# Altium project motor_driver_unit_v0.PrjPcb
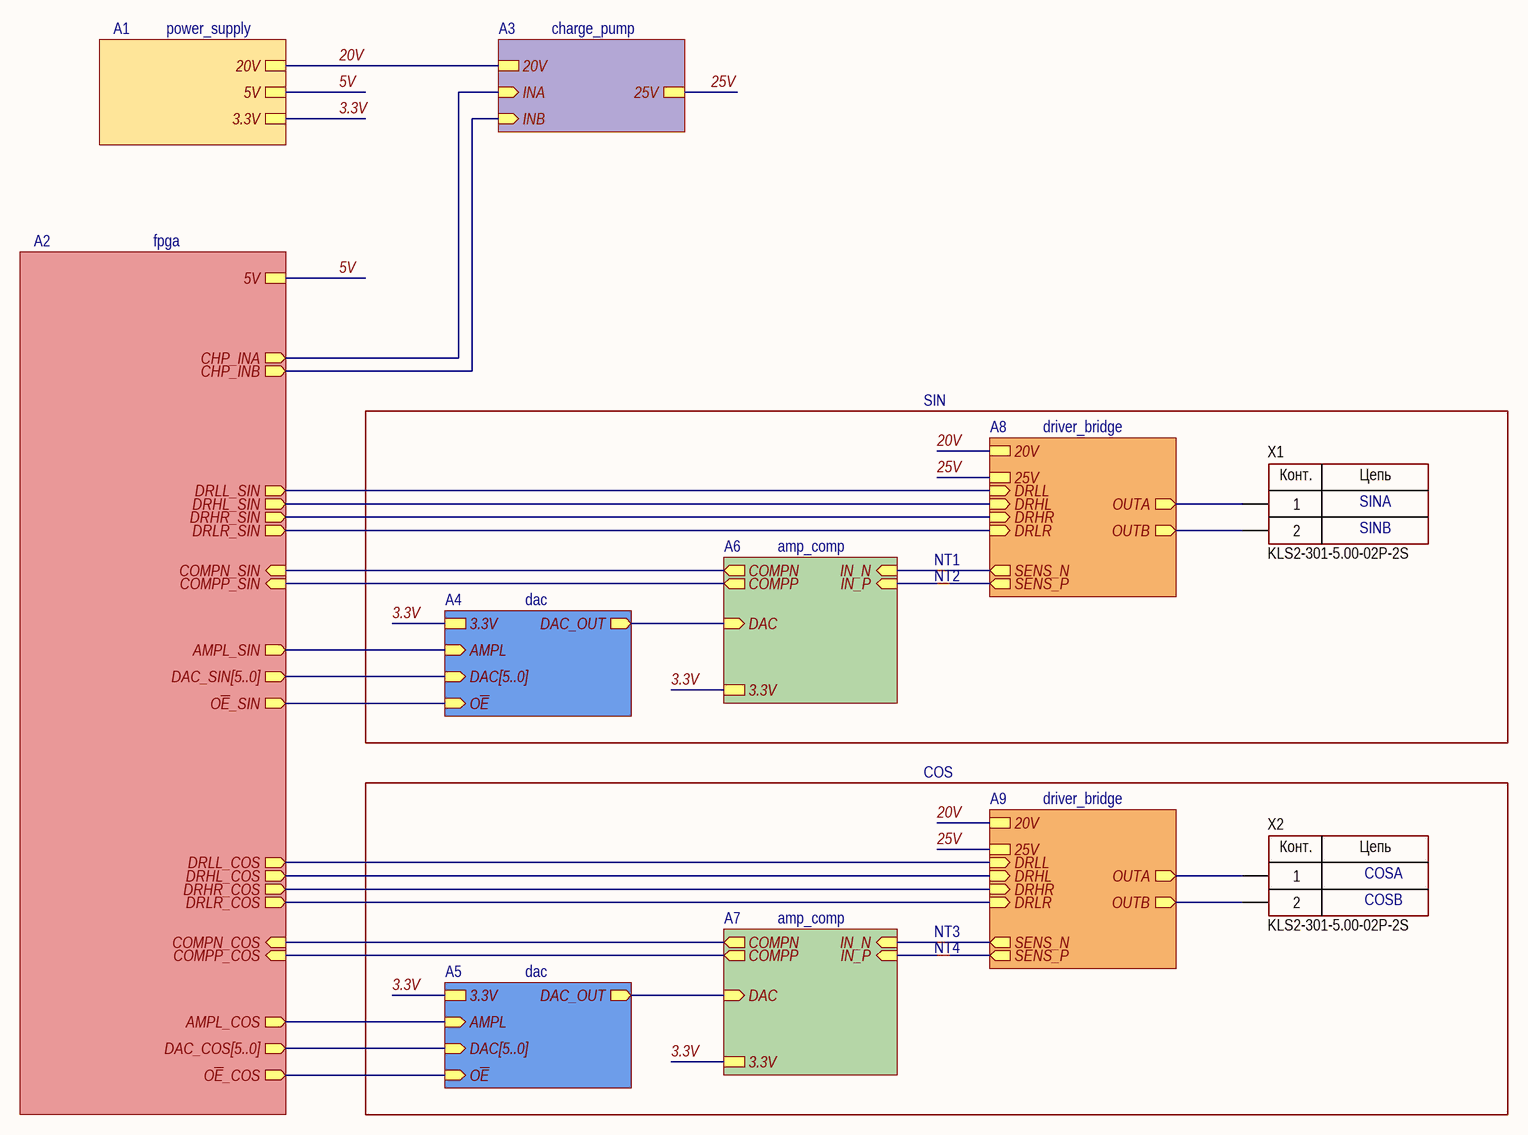
[diagram p0: main.SchDoc]
7 sheets, 191 parts. Net scope: hierarchical (ports join the sheet entries above them; power ports are global).
Board file: motor_driver_unit_pcb.PcbDoc
Sheets:
  main.SchDoc
    A3 = charge_pump.SchDoc
    A8 = driver_bridge.SchDoc
    A6 = amp_comp.SchDoc
    A4 = dac.SchDoc
    A1 = power_supply.SchDoc
    A2 = fpga.SchDoc
    A9 = driver_bridge.SchDoc
    A7 = amp_comp.SchDoc
    A5 = dac.SchDoc

## Sheet main.SchDoc
size 420 x 297 mm; Address1: Address1; Address2: Address2; Address3: Address3; Address4: Address4; DocumentNumber: АБВГ.123456.001 Э3; SheetNumber: 1; SheetTotal: 7; Scale: 1:1; DocumentType: Схема электрическая принципиальная; FirstReferrence: АБВГ.123456.001

### Parts
NT1  Net_Tie  [NET TIE 0.5_1.5]  (value not drawn)
NT2  Net_Tie  [NET TIE 0.5_1.5]  (value not drawn)
NT3  Net_Tie  [NET TIE 0.5_1.5]  (value not drawn)
NT4  Net_Tie  [NET TIE 0.5_1.5]  (value not drawn)
X1  CommentText: KLS2-301-5.00-02P-2S  [CON: Terminal 2p 5mm]
X2  CommentText: KLS2-301-5.00-02P-2S  [CON: Terminal 2p 5mm]

### Sub-sheets
A1 = power_supply: 3.3V, 5V, 20V
A2 = fpga: CHP_INA (out), 5V, DAC_SIN[5..0] (out), COMPN_SIN (in), COMPP_SIN (in), DRLR_SIN (out), DRHR_SIN (out), DRHL_SIN (out), DRLL_SIN (out), DRLL_COS (out), DRHL_COS (out), DRHR_COS (out), DRLR_COS (out), DAC_COS[5..0] (out), AMPL_SIN (out), O~{E}_SIN (out), AMPL_COS (out), O~{E}_COS (out), COMPN_COS (in), COMPP_COS (in), CHP_INB (out)
A3 = charge_pump: 20V, 25V, INA (in), INB (in)
A4 = dac: 3.3V, DAC_OUT (out), DAC[5..0] (in), AMPL (in), O~{E} (in)
A5 = dac: 3.3V, DAC_OUT (out), DAC[5..0] (in), AMPL (in), O~{E} (in)
A6 = amp_comp: 3.3V, DAC (in), COMPN (out), COMPP (out), IN_N (in), IN_P (in)
A7 = amp_comp: 3.3V, DAC (in), COMPN (out), COMPP (out), IN_N (in), IN_P (in)
A8 = driver_bridge: 20V, 25V, OUTA (out), OUTB (out), SENS_N (out), SENS_P (out), DRLL (in), DRHL (in), DRHR (in), DRLR (in)
A9 = driver_bridge: 20V, 25V, OUTA (out), OUTB (out), SENS_N (out), SENS_P (out), DRLL (in), DRHL (in), DRHR (in), DRLR (in)

### Nets
3.3V: sheet A6/3.3V, sheet A4/3.3V, sheet A1/3.3V, sheet A7/3.3V, sheet A5/3.3V
5V: sheet A1/5V, sheet A2/5V
20V: sheet A3/20V, sheet A8/20V, sheet A1/20V, sheet A9/20V
25V: sheet A3/25V, sheet A8/25V, sheet A9/25V
COMPN: sheet A6/COMPN, sheet A2/COMPN_SIN
COMPN: sheet A2/COMPN_COS, sheet A7/COMPN  [a separate net that carries the same name]
COMPP: sheet A6/COMPP, sheet A2/COMPP_SIN
COMPP: sheet A2/COMPP_COS, sheet A7/COMPP  [a separate net that carries the same name]
DAC: sheet A6/DAC, sheet A4/DAC_OUT
DAC: sheet A7/DAC, sheet A5/DAC_OUT  [a separate net that carries the same name]
OUTA: X1.1 ; sheet A8/OUTA
OUTA: X2.1 ; sheet A9/OUTA  [a separate net that carries the same name]
OUTB: X1.2 ; sheet A8/OUTB
OUTB: X2.2 ; sheet A9/OUTB  [a separate net that carries the same name]
SENS_N: NT1.2 ; sheet A8/SENS_N
SENS_N: NT3.2 ; sheet A9/SENS_N  [a separate net that carries the same name]
SENS_P: NT2.2 ; sheet A8/SENS_P
SENS_P: NT4.2 ; sheet A9/SENS_P  [a separate net that carries the same name]
NetD4_2: sheet A3/INA, sheet A2/CHP_INA
NetD4_4: sheet A3/INB, sheet A2/CHP_INB
NetD5_A4_8: sheet A4/O~{E}, sheet A2/O~{E}_SIN
NetD5_A5_8: sheet A2/O~{E}_COS, sheet A5/O~{E}
NetD10_A8_2: sheet A8/DRHL, sheet A2/DRHL_SIN
NetD10_A8_4: sheet A8/DRHR, sheet A2/DRHR_SIN
NetD10_A9_2: sheet A2/DRHL_COS, sheet A9/DRHL
NetD10_A9_4: sheet A2/DRHR_COS, sheet A9/DRHR
NetD11_A8_2: sheet A8/DRLL, sheet A2/DRLL_SIN
NetD11_A8_4: sheet A8/DRLR, sheet A2/DRLR_SIN
NetD11_A9_2: sheet A2/DRLL_COS, sheet A9/DRLL
NetD11_A9_4: sheet A2/DRLR_COS, sheet A9/DRLR
NetNT1_1: NT1.1 ; sheet A6/IN_N
NetNT2_1: NT2.1 ; sheet A6/IN_P
NetNT3_1: NT3.1 ; sheet A7/IN_N
NetNT4_1: NT4.1 ; sheet A7/IN_P
NetR6_A4_2: sheet A4/AMPL, sheet A2/AMPL_SIN
NetR6_A5_2: sheet A2/AMPL_COS, sheet A5/AMPL

### Buses and harness runs
bus sheet A2/DAC_COS[5..0] = sheet A5/DAC[5..0]
bus sheet A2/DAC_SIN[5..0] = sheet A4/DAC[5..0]

### Notes on the sheet
- SIN
- SINA
- SINB
- COS
- COSA
- COSB
- Перв. примен.
- Справ. №
- Подп. и дата
- Инв. № дубл.
- Взам. инв. №
- Разраб.
- Изм.
- Лист
- № докум.
- Подп.
- Дата
- Лит.
- Масса
- Масштаб
- Пров.
- Т.контр.
- Листов
- Инв. № подл.
- Утв.
- Н.контр.
- 2.106-A3
- Копировал
- Формат А3
- (in symbol Terminal block 2) Конт.; Цепь

### Library data of the parts
X1 X2 = Terminal block 2: ValueManufacturerPartNumber: Connector, 2pin, *, *, *; TypeConnector: Connector; Multichannel: 2pin; Manufacturer: *; HelpURL: *; PartNumber: KLS2-301-5.00-02P-2S; VoltageMax: *; Pitch: *; CurrentMax: *

## Sheet charge_pump.SchDoc
size 420 x 297 mm; Address1: Address1; Address2: Address2; Address3: Address3; Address4: Address4; DocumentNumber: АБВГ.123456.001 Э3; SheetNumber: 4; SheetTotal: 7; Scale: 1:1; DocumentType: Схема электрическая принципиальная; FirstReferrence: АБВГ.123456.001
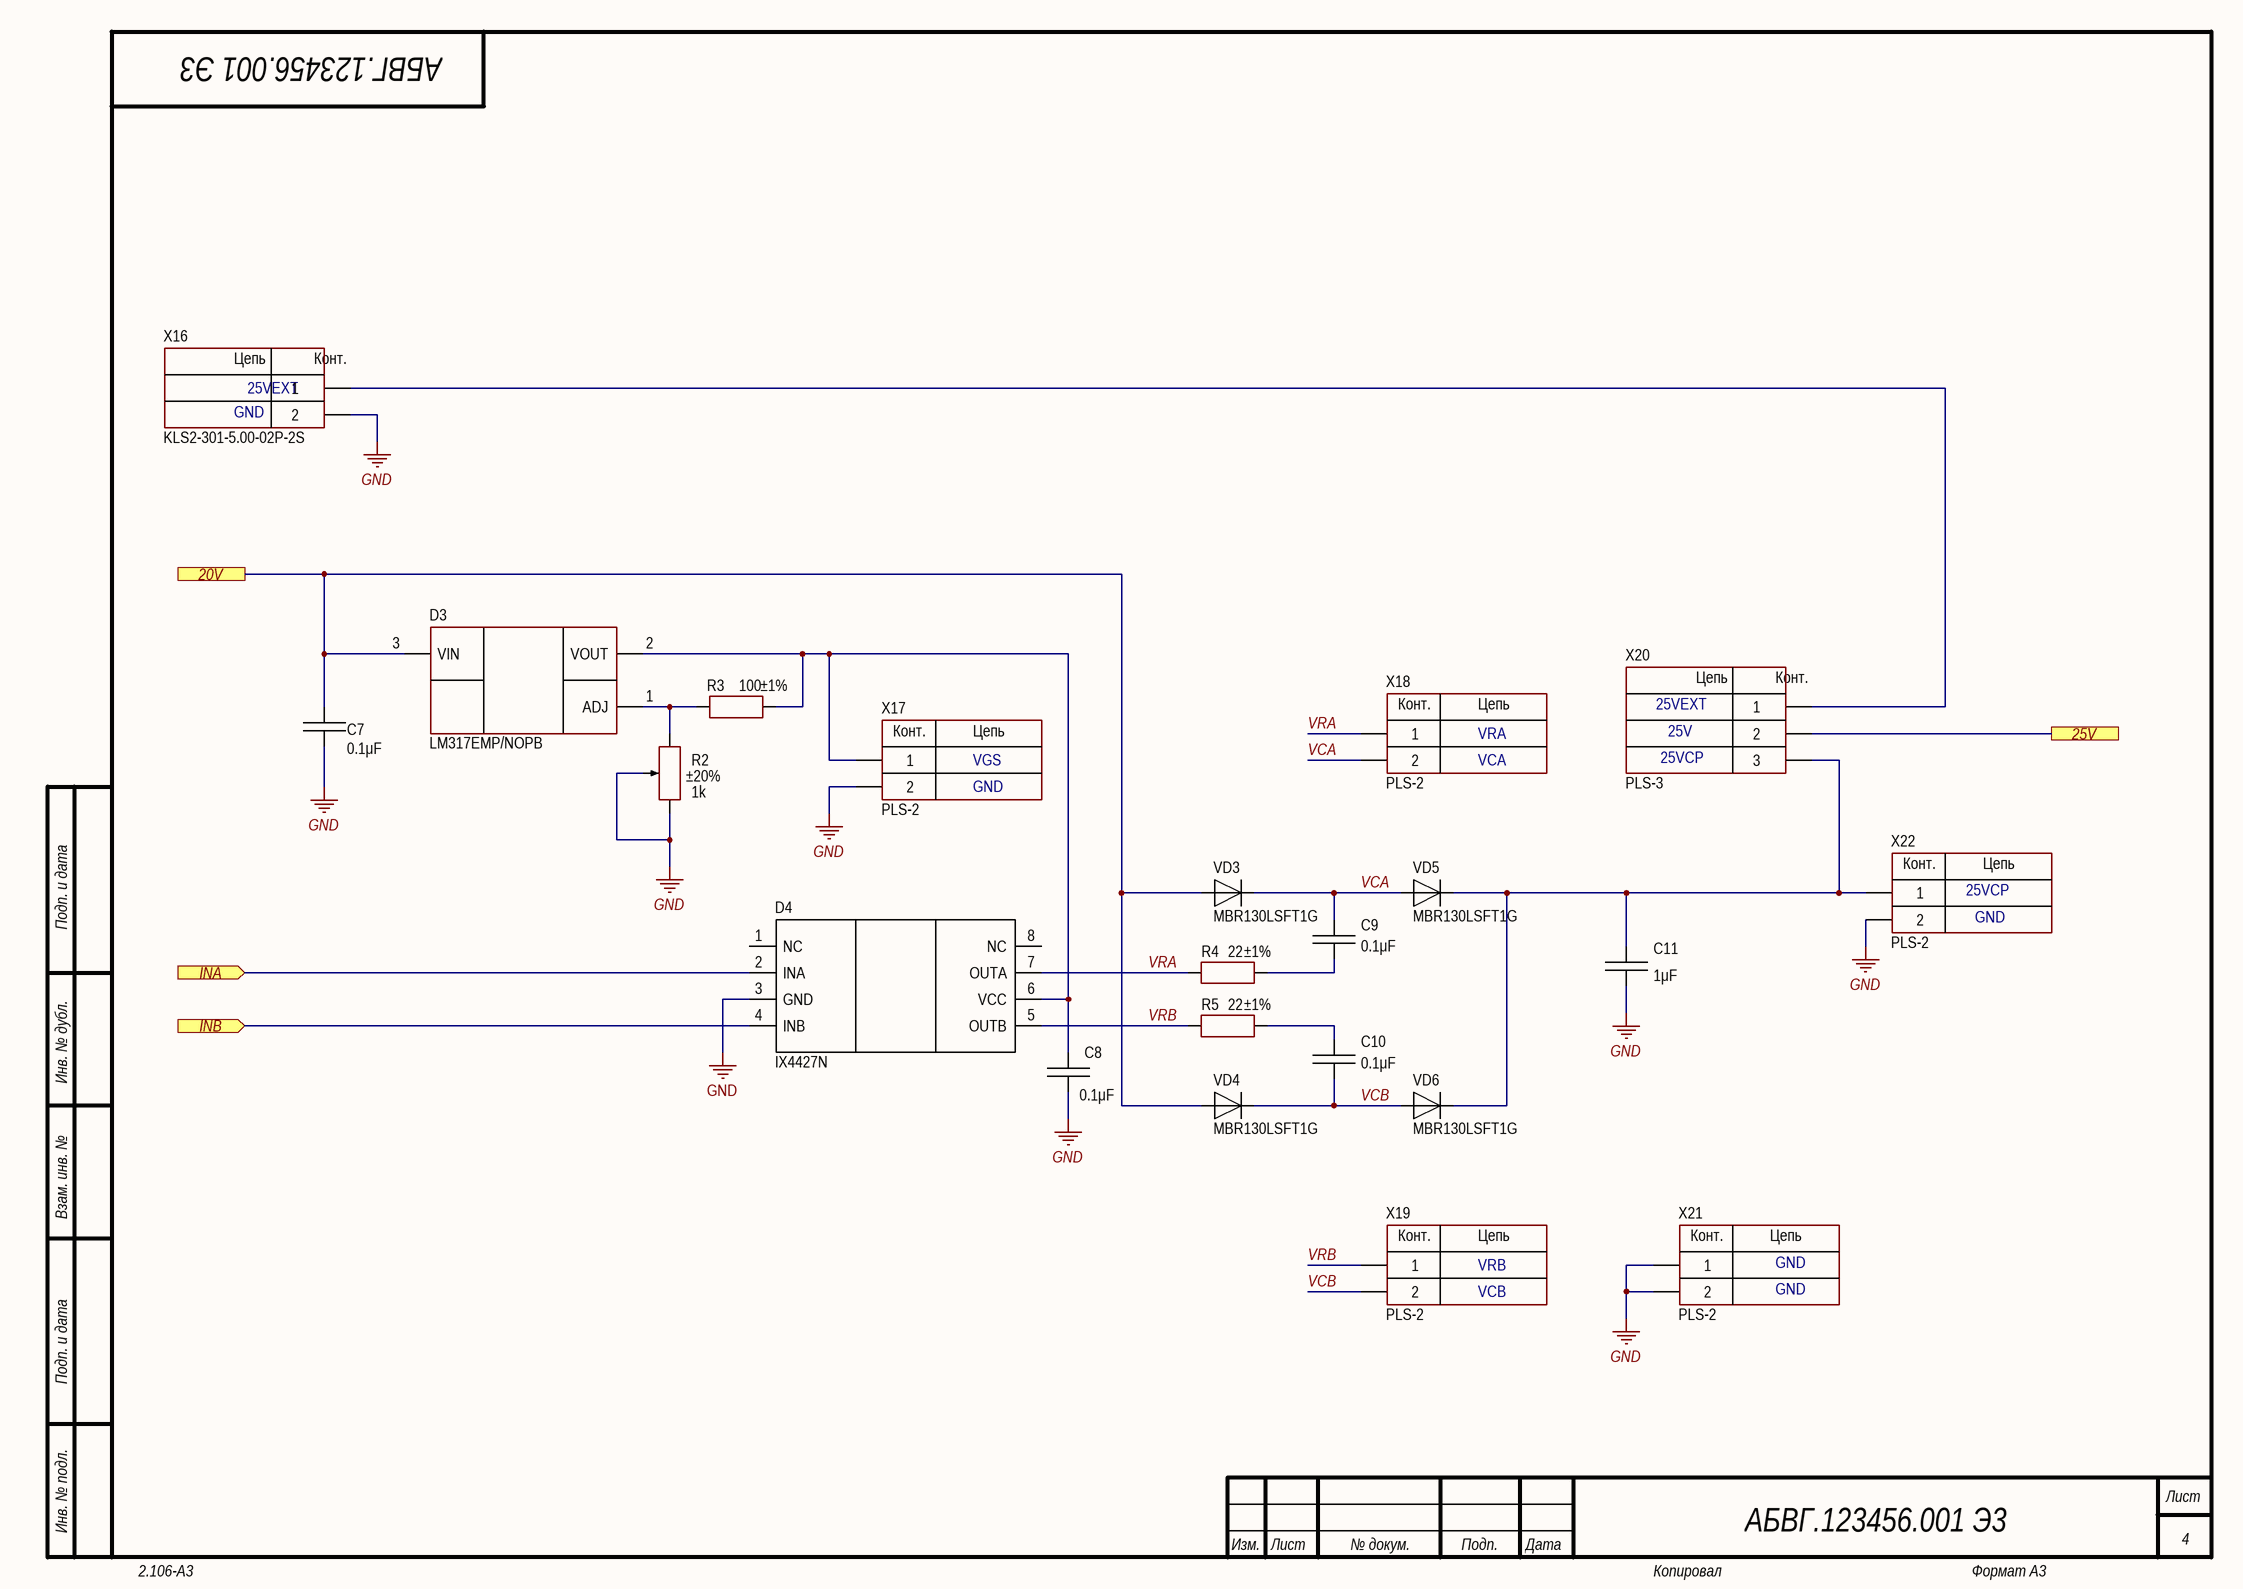
[diagram p1: charge_pump.SchDoc]

### Parts
C7  value 0.1μF  [CAP: 1206]
C8  value 0.1μF  [CAP: 1206]
C9  value 0.1μF  [CAP: 1206]
C10  value 0.1μF  [CAP: 1206]
C11  value 1μF  [CAP: 1206]
D3  PartNumber: LM317EMP/NOPB  [SOT223]  (hidden comment: *)
D4  Ixys Corporation  [8-SOIC]  (value not drawn)
R2  value 1k  Tolerance: ±20%  [RES: 3314G]
R3  value 100  Tolerance: ±1%  [RES: 1206]
R4  value 22  Tolerance: ±1%  [RES: 1206]
R5  value 22  Tolerance: ±1%  [RES: 1206]
VD3  PartNumber: MBR130LSFT1G  [DIODE: SOD123F]
VD4  PartNumber: MBR130LSFT1G  [DIODE: SOD123F]
VD5  PartNumber: MBR130LSFT1G  [DIODE: SOD123F]
VD6  PartNumber: MBR130LSFT1G  [DIODE: SOD123F]
X16  CommentText: KLS2-301-5.00-02P-2S  [CON: Terminal 2p 5mm]
X17  (no value)  [CON: PLS-2]
X18  (no value)  [CON: PLS-2]
X19  (no value)  [CON: PLS-2]
X20  (no value)  [CON: PLS-3]
X21  (no value)  [CON: PLS-2]
X22  (no value)  [CON: PLS-2]

### Ports
20V, 25V, INA (in), INB (in)

### Nets
GND: C7.1 C8.1 C11.1 D4.3(GND) R2.1 R2.2 X16.2 X17.2 X21.1 X21.2 X22.2
20V: C7.2 D3.3(VIN) VD3.1 VD4.1 ; port 20V
25V: X20.2 ; port 25V
VCA: C9.2 VD3.2 VD5.1 X18.2
VCB: C10.1 VD4.2 VD6.1 X19.2
VRA: D4.7(OUTA) R4.2 X18.1
VRB: D4.5(OUTB) R5.2 X19.1
NetC8_2: C8.2 D3.2(VOUT) D4.6(VCC) R3.1 X17.1
NetC9_1: C9.1 R4.1
NetC10_2: C10.2 R5.1
NetC11_2: C11.2 VD5.2 VD6.2 X20.3 X22.1
NetD3_1: D3.1(ADJ) R2.3 R3.2
NetD4_2: D4.2(INA) ; port INA
NetD4_4: D4.4(INB) ; port INB
NetX16_1: X16.1 X20.1

Not connected (* = marked no-connect by the designer): D4 1(NC) 8(NC)

### Notes on the sheet
- 25VEXT
- GND
- VGS
- VCA
- VRA
- 25VCP
- 25V
- VRB
- VCB
- Подп. и дата
- Инв. № дубл.
- Взам. инв. №
- Инв. № подл.
- Изм.
- Лист
- № докум.
- Подп.
- Дата
- 2.106-A3
- Копировал
- Формат А3
- (in symbol PLS-2) Конт.; Цепь
- (in symbol PLS-3) Цепь; Конт.
- (in symbol Terminal block 2) Цепь; Конт.

### Library data of the parts
C7-C10 = Ceramic_1206: Manufacturer: Murata Electronics; PartNumber: GRM319R71H104K; ValueManufacturerPartNumber: Ceramic capacitor, 0.1μF, X7R, ±10%, 50V, 1206, -55...+125°C; TypeCapacitor: Ceramic capacitor; Tolerance: ±10%; TypeDielectric: X7R; Voltage: 50V; Package: 1206; HelpURL: https://www.chipdip.ru/product/grm319r71h104k; Temperature: -55...+125°C
C11 = Ceramic_1206: Manufacturer: Murata Electronics; PartNumber: GRM31MR71E105K; ValueManufacturerPartNumber: Ceramic capacitor, 1μF, X7R, ±10%, 50V, 1206, -55...+125°C; TypeCapacitor: Ceramic capacitor; Tolerance: ±10%; TypeDielectric: X7R; Voltage: 50V; Package: 1206; HelpURL: https://www.chipdip.ru/product/grm31mr71e105k; Temperature: -55...+125°C
D3 = AMS1117-5.0: Three-Pin Adjustable Regulator; Manufacturer: Texas Instruments; HelpURL: https://www.chipdip.ru/product/lm317emp-nopb; Package: SOT223; ComponentType: Three-Pin Adjustable Regulator; ValueManufacturerPartNumber: *; Temperature: *; VoltageInput: *; MaxDropout: *; CurrentOutput: *; VoltageOutput: *
D4 = IX4427N: Gate driver; Manufacturer: Ixys Corporation; HelpURL: https://www.chipdip.ru/product/ix4427n; Package: SOIC-8; ComponentType: Gate driver; PartNumber: IX4427N
R2 = Trimmer: Manufacturer: Bourns; PartNumber: 3314G-1-103E; Power: 0.25W; Package: 3314G; HelpURL: https://www.chipdip.ru/product/3314g-1-103e; ValueManufacturerPartNumber: =TypeResistor+', '+Value+', '+Tolerance+', '+Package+', '+Power+', '+Temperature; Temperature: -55...+125°C
R3 = Resistor_1206: Manufacturer: Yageo; PartNumber: RC1206JR-07100RL; ValueManufacturerPartNumber: Resistor film, 100, ±1%, 1206, 0.25W, -55...+125°C; TypeResistor: Resistor film; Power: 0.25W; Package: 1206; HelpURL: https://www.chipdip.ru/product0/9000079905; Temperature: -55...+125°C
R4 R5 = Resistor_1206: Manufacturer: Yageo; PartNumber: RC1206JR-07100RL; ValueManufacturerPartNumber: Resistor film, 22, ±1%, 1206, 0.25W, -55...+125°C; TypeResistor: Resistor film; Power: 0.25W; Package: 1206; HelpURL: https://www.chipdip.ru/product0/9000079905; Temperature: -55...+125°C
VD3-VD6 = Diode_single: Manufacturer: ON Semiconductor; TypeDiode: Single diode; Voltage: 30V; Current: 1A; VoltageDrop: 380mV; Package: SOD-123FL; HelpURL: https://www.chipdip.ru/product/mbr130lsft1g; ValueManufacturerPartNumber: =TypeDiode+', '+Voltage+', '+Current+', '+VoltageDrop+', '+RecoveryTime+', '+Package+', '+Temperature; Temperature: -55…+125 C
X16 = Terminal block 2: as X1 on sheet main; Manufacturer: *; HelpURL: *; PartNumber: KLS2-301-5.00-02P-2S; VoltageMax: *; Pitch: *; CurrentMax: *
X17-X19 X21 X22 = PLS-2: Manufacturer: Connfly; ValueManufacturerPartNumber: Connector, 2pin, 2.54mm, 500VAC, 3A; TypeConnector: Connector; VoltageMax: 500VAC; Pitch: 2.54mm; CurrentMax: 3A; Multichannel: 2pin; HelpURL: https://www.chipdip.ru/product/pls-2; PartNumber: PLS-2; CommentText: PLS-2
X20 = PLS-3: Manufacturer: Connfly; ValueManufacturerPartNumber: Connector, 3pin, 2.54mm, 500VAC, 3A; TypeConnector: Connector; VoltageMax: 500VAC; Pitch: 2.54mm; CurrentMax: 3A; Multichannel: 3pin; HelpURL: https://www.chipdip.ru/product/pls-3; PartNumber: PLS-3; CommentText: PLS-3

## Sheet driver_bridge.SchDoc
size 420 x 297 mm; Address1: Address1; Address2: Address2; Address3: Address3; Address4: Address4; DocumentNumber: АБВГ.123456.001 Э3; SheetNumber: 7; SheetTotal: 7; Scale: 1:1; DocumentType: Схема электрическая принципиальная; FirstReferrence: АБВГ.123456.001
Used 2 times, as channels A8, A9. Parts and nets are listed once, with the designators drawn on the sheet.
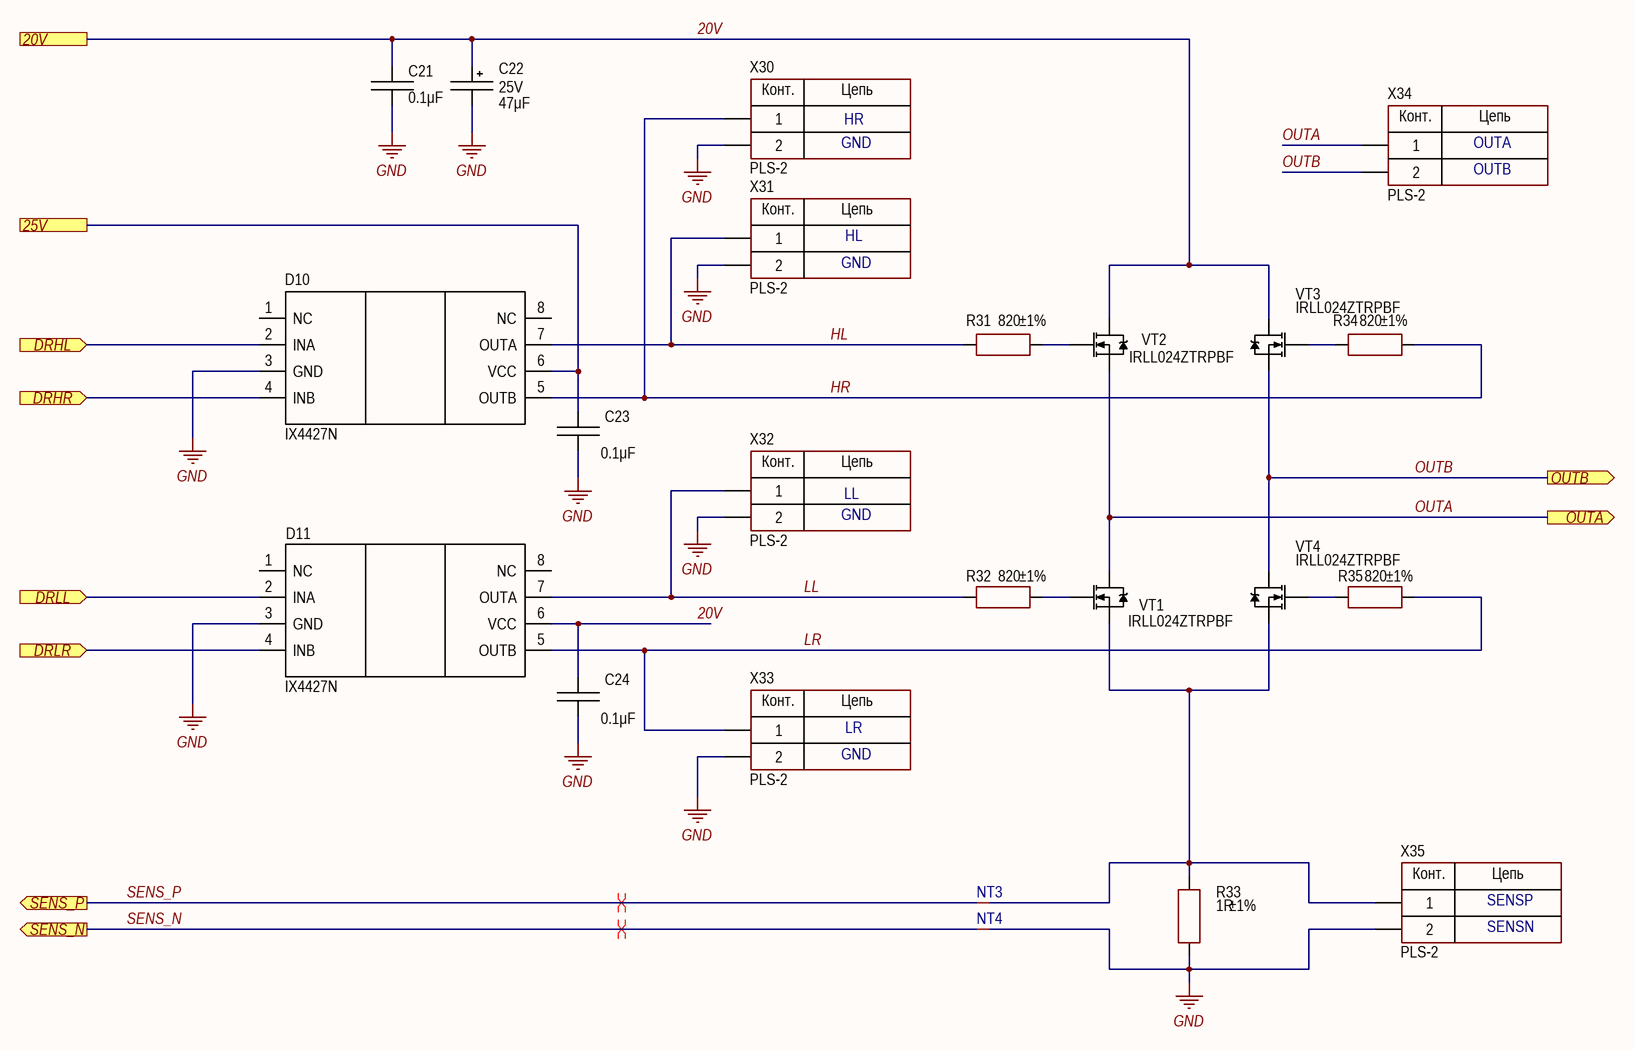
[diagram p2: driver_bridge.SchDoc]

### Parts
C21  value 0.1μF  [CAP: 1206]
C22  value 47μF  Voltage: 25V  [CAP: D6.3C2.5H11]
C23  value 0.1μF  [CAP: 1206]
C24  value 0.1μF  [CAP: 1206]
D10  Ixys Corporation  [8-SOIC]  (value not drawn)
D11  Ixys Corporation  [8-SOIC]  (value not drawn)
NT3  Net_Tie  [NET TIE 0.5_1.5]  (value not drawn)
NT4  Net_Tie  [NET TIE 0.5_1.5]  (value not drawn)
R31  value 820  Tolerance: ±1%  [RES: 1206]
R32  value 820  Tolerance: ±1%  [RES: 1206]
R33  value 1R  Tolerance: ±1%  [RES: 2512]
R34  value 820  Tolerance: ±1%  [RES: 1206]
R35  value 820  Tolerance: ±1%  [RES: 1206]
VT1  PartNumber: IRLL024ZTRPBF  [SOT223]
VT2  PartNumber: IRLL024ZTRPBF  [SOT223]
VT3  PartNumber: IRLL024ZTRPBF  [SOT223]
VT4  PartNumber: IRLL024ZTRPBF  [SOT223]
X30  (no value)  [CON: PLS-2]
X31  (no value)  [CON: PLS-2]
X32  (no value)  [CON: PLS-2]
X33  (no value)  [CON: PLS-2]
X34  (no value)  [CON: PLS-2]
X35  (no value)  [CON: PLS-2]

### Ports
20V, 25V, DRHL (in), DRHR (in), DRLL (in), DRLR (in), OUTA (out), OUTB (out), SENS_N (out), SENS_P (out)

### Nets
GND: C21.1 C22.2 C23.1 C24.1 D10.3(GND) D11.3(GND) NT4.2 R33.1 X30.2 X31.2 X32.2 X33.2 X35.2
20V: C21.2 C22.1 C24.2 D11.6(VCC) VT2.2(D) VT3.2(D) ; port 20V
25V: C23.2 D10.6(VCC) ; port 25V
DRHL: D10.2(INA) ; port DRHL
DRHR: D10.4(INB) ; port DRHR
DRLL: D11.2(INA) ; port DRLL
DRLR: D11.4(INB) ; port DRLR
HL: D10.7(OUTA) R31.1 X31.1
HR: D10.5(OUTB) R34.2 X30.1
LL: D11.7(OUTA) R32.1 X32.1
LR: D11.5(OUTB) R35.2 X33.1
OUTA: VT1.2(D) VT2.3(S) X34.1 ; port OUTA
OUTB: VT3.3(S) VT4.2(D) X34.2 ; port OUTB
SENS_N: NT4.1 ; port SENS_N
SENS_P: NT3.1 ; port SENS_P
NetNT3_2: NT3.2 R33.2 VT1.3(S) VT4.3(S) X35.1
NetR31_2: R31.2 VT2.1(G)
NetR32_2: R32.2 VT1.1(G)
NetR34_1: R34.1 VT3.1(G)
NetR35_1: R35.1 VT4.1(G)

Not connected (* = marked no-connect by the designer): D10 1(NC) 8(NC); D11 1(NC) 8(NC)

### Channels
A8: designators end in _A8; ports 20V=20V 25V=25V DRHL=NetD10_A8_2 DRHR=NetD10_A8_4 DRLL=NetD11_A8_2 DRLR=NetD11_A8_4 OUTA=OUTA OUTB=OUTB SENS_N=SENS_N SENS_P=SENS_P
A9: designators end in _A9; ports 20V=20V 25V=25V DRHL=NetD10_A9_2 DRHR=NetD10_A9_4 DRLL=NetD11_A9_2 DRLR=NetD11_A9_4 OUTA=OUTA OUTB=OUTB SENS_N=SENS_N SENS_P=SENS_P

### Layout directives
differential pair: SENS_N, SENS_P

### Notes on the sheet
- HR
- GND
- OUTB
- OUTA
- HL
- LL
- LR
- SENSN
- SENSP
- Подп. и дата
- Инв. № дубл.
- Взам. инв. №
- Инв. № подл.
- Изм.
- Лист
- № докум.
- Подп.
- Дата
- 2.106-A3
- Копировал
- Формат А3
- (in symbol PLS-2) Конт.; Цепь

### Library data of the parts
C21 C23 C24 = Ceramic_1206: as C7 on sheet charge_pump; Package: 1206; HelpURL: https://www.chipdip.ru/product/grm319r71h104k; Temperature: -55...+125°C
C22 = Aluminium: Manufacturer: Wurth; PartNumber: 860080475013; ValueManufacturerPartNumber: Aluminium capacitor, 47μF, 25V, ±20%, 54mOhm, 14x10x5 mm, -55...+105°C; TypeCapacitor: Aluminium capacitor; Tolerance: ±20%; Impedance: 54mOhm; Package: 14x10x5 mm; HelpURL: https://www.digikey.com/product-detail/en/wurth-electronics-inc/860080475013/732-9029-1-ND/5728972; Temperature: -55...+105°C
D10 D11 = IX4427N: Gate driver; Manufacturer: Ixys Corporation; HelpURL: https://www.chipdip.ru/product/ix4427n; Package: SOIC-8; ComponentType: Gate driver; PartNumber: IX4427N
R31 R32 R34 R35 = Resistor_1206: Manufacturer: Yageo; PartNumber: RC1206JR-07100RL; ValueManufacturerPartNumber: Resistor film, 820, ±1%, 1206, 0.25W, -55...+125°C; TypeResistor: Resistor film; Power: 0.25W; Package: 1206; HelpURL: https://www.digikey.com/product-detail/en/yageo/RC1206JR-07100RL/311-100ERCT-ND/732153; Temperature: -55...+125°C
R33 = Resistor_2512: Manufacturer: Yageo; PartNumber: RC2512JK-07100RL; ValueManufacturerPartNumber: Resistor film, 1R, ±1%, 2512, 1W, -55...+125°C; TypeResistor: Resistor film; Power: 1W; Package: 2512; HelpURL: https://www.digikey.com/product-detail/en/yageo/RC2512JK-07100RL/YAG3393CT-ND/5962215; Temperature: -55...+125°C
VT1 = MOSFET_N_123: Manufacturer: Infineon Technologies; TypeTransistor: MOSFET N-channel transistor; VoltageDS: 55V; CurrentD: 4A; RDS: 60mOhm; GateCharge: 7nC ( Typ.); InputCapacitance: 380pF; MaxPower: 1W; Package: SOT-223; HelpURL: https://www.chipdip.ru/product/irll024ztrpbf-infineon; ValueManufacturerPartNumber: =TypeTransistor+', '+VoltageDS+', '+CurrentDS+', '+GateCharge+', '+MaxPower+', '+RDS+', '+InputCapacitor+', '+Package+', '+Temperature; Temperature: -55...+150°C
VT2-VT4 = MOSFET_N_123: Manufacturer: Infineon Technologies; TypeTransistor: MOSFET N-channel transistor; VoltageDS: 55V; CurrentD: 4A; RDS: 60mOhm; GateCharge: 7nC ( Typ.); InputCapacitance: 380pF; MaxPower: 1W; Gate Threshold Voltage: 3V; VGS Max.: ±16V; Package: SOT-223; HelpURL: https://www.chipdip.ru/product/irll024ztrpbf-infineon; ValueManufacturerPartNumber: =TypeTransistor+', '+VoltageDS+', '+CurrentDS+', '+GateCharge+', '+MaxPower+', '+RDS+', '+InputCapacitor+', '+Package+', '+Temperature; Temperature: -55...+150°C
X30-X35 = PLS-2: Manufacturer: Connfly; ValueManufacturerPartNumber: Connector, 2pin, 2.54mm, 500VAC, 3A; TypeConnector: Connector; VoltageMax: 500VAC; Pitch: 2.54mm; CurrentMax: 3A; Multichannel: 2pin; CommentText: "Разъем"; HelpURL: https://www.chipdip.ru/product/pls-2; PartNumber: PLS-2

## Sheet amp_comp.SchDoc
size 420 x 297 mm; Address1: Address1; Address2: Address2; Address3: Address3; Address4: Address4; DocumentNumber: АБВГ.123456.001 Э3; SheetNumber: 6; SheetTotal: 7; Scale: 1:1; DocumentType: Схема электрическая принципиальная; FirstReferrence: АБВГ.123456.001
Used 2 times, as channels A6, A7. Parts and nets are listed once, with the designators drawn on the sheet.
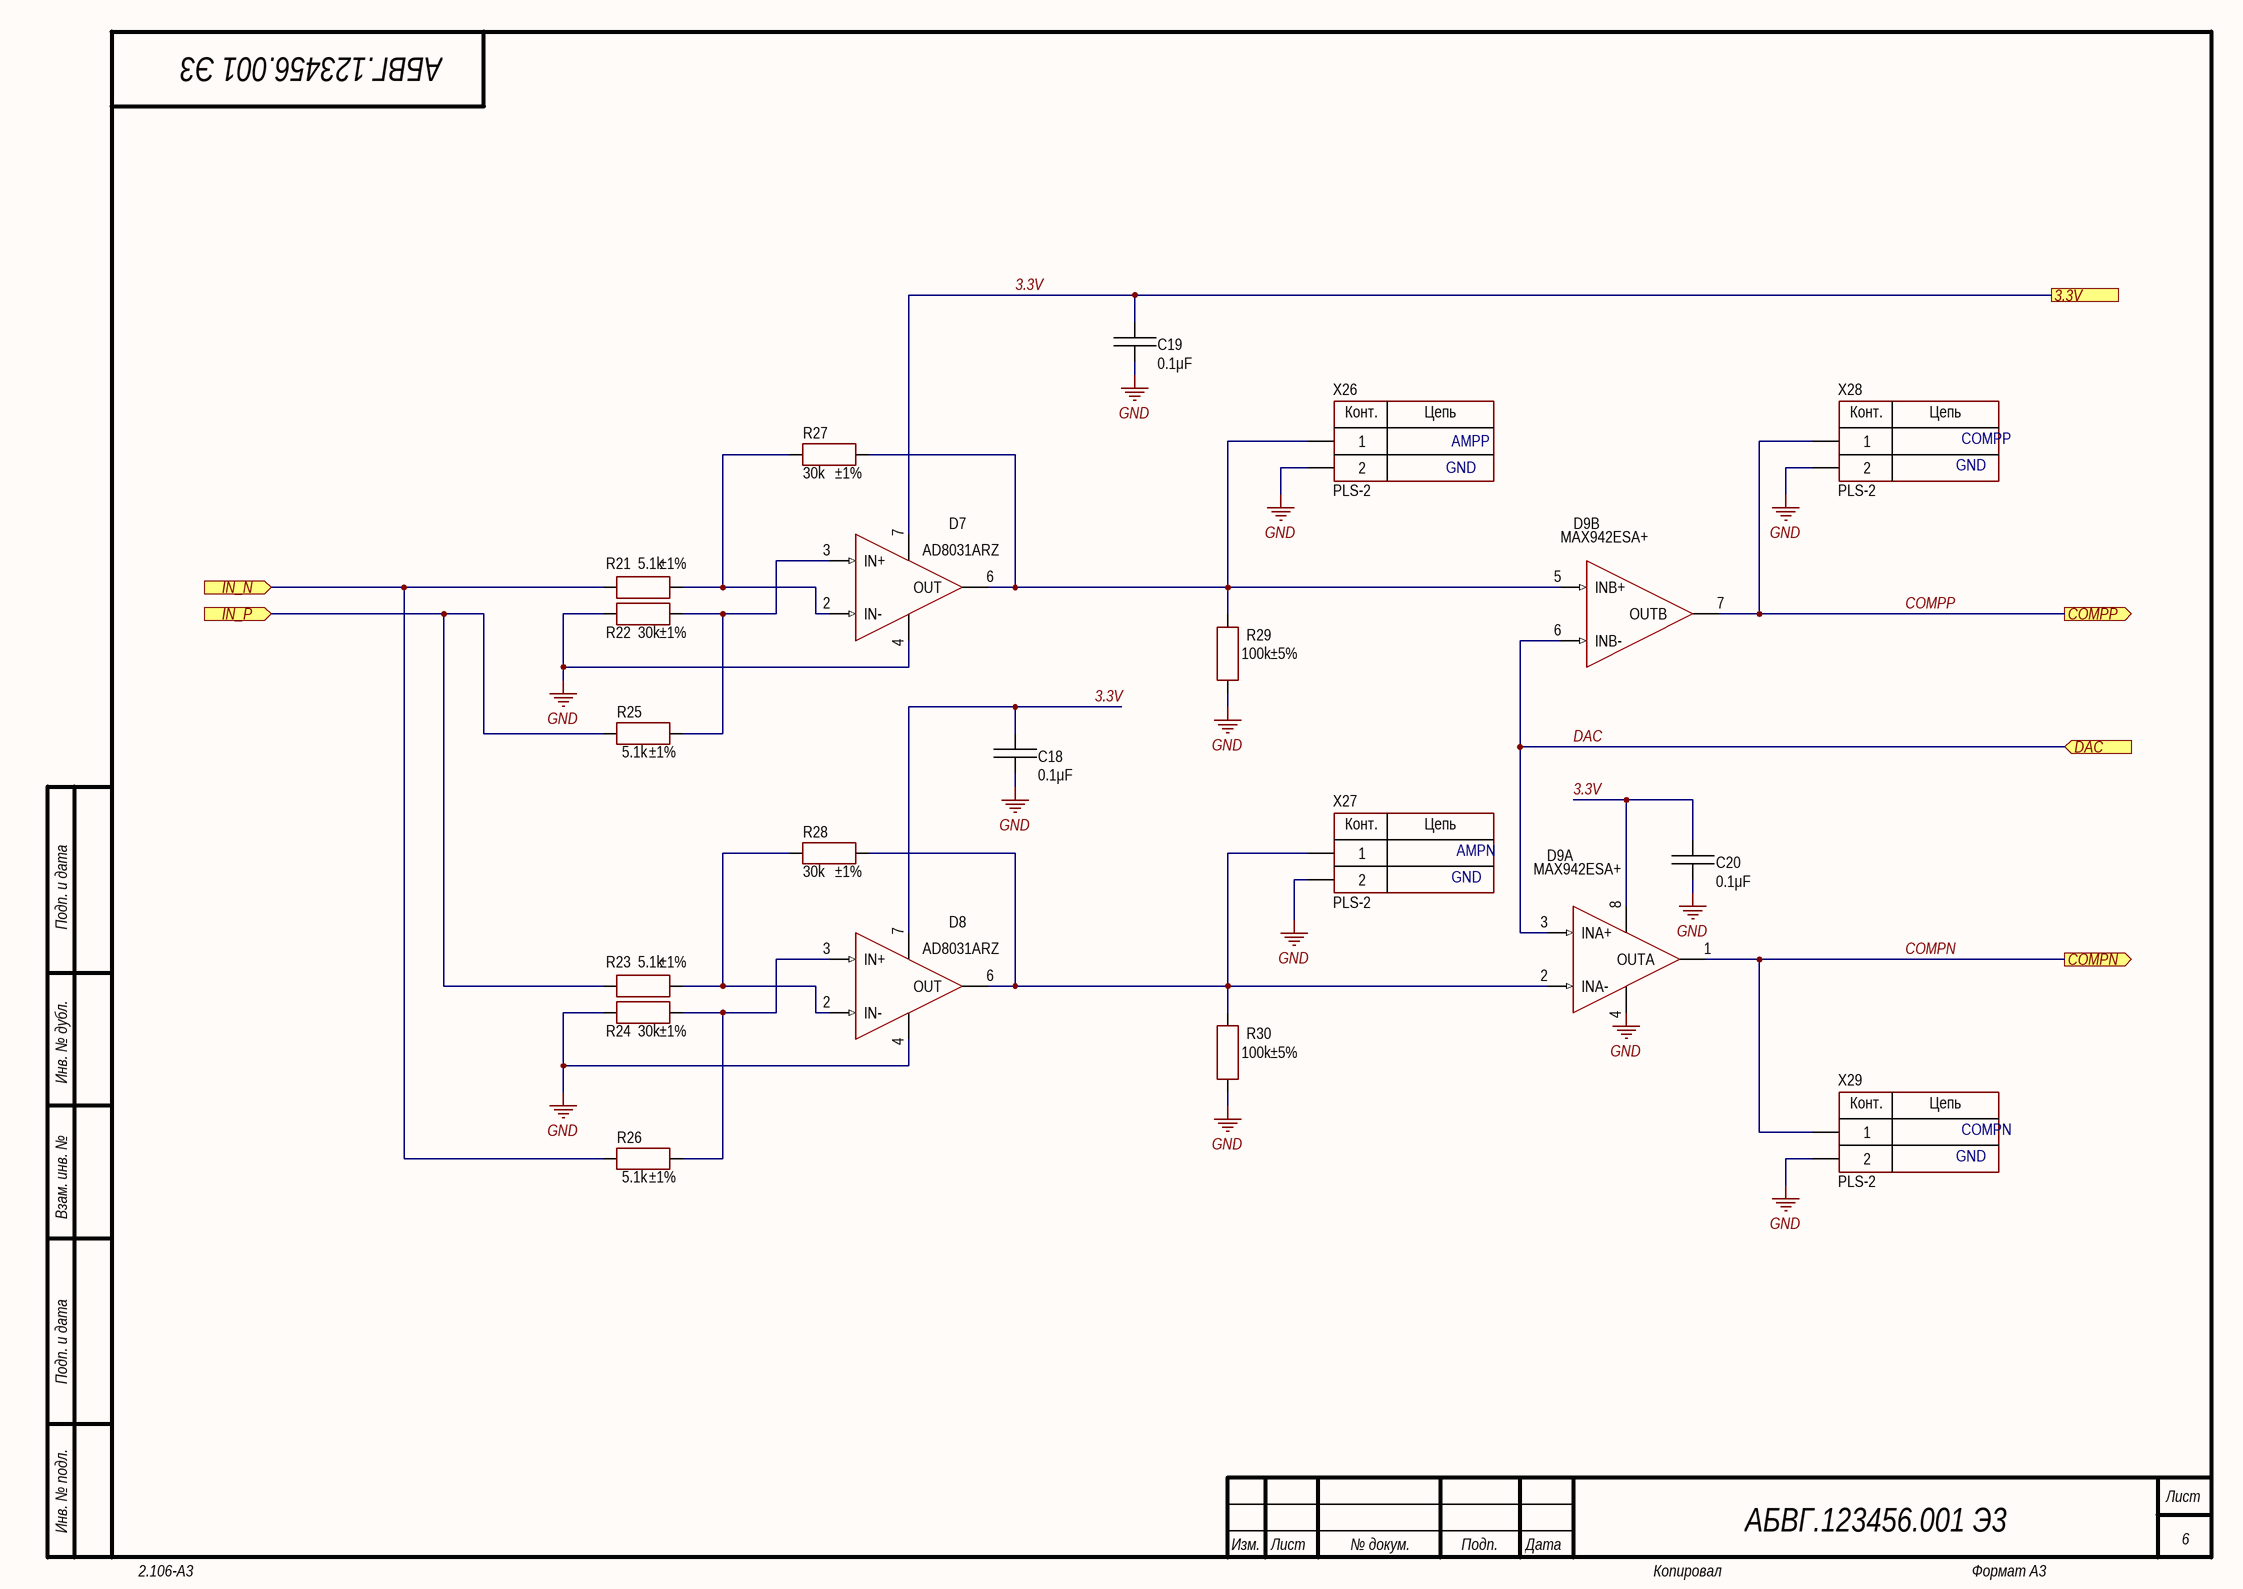
[diagram p3: amp_comp.SchDoc]

### Parts
C18  value 0.1μF  [CAP: 1206]
C19  value 0.1μF  [CAP: 1206]
C20  value 0.1μF  [CAP: 1206]
D7  (no value)  [8-SOIC]
D8  (no value)  [8-SOIC]
D9  PartNumber: MAX942ESA+  [8-SOIC]  (parts A,B of 2)
R21  value 5.1k  Tolerance: ±1%  [RES: 1206]
R22  value 30k  Tolerance: ±1%  [RES: 1206]
R23  value 5.1k  Tolerance: ±1%  [RES: 1206]
R24  value 30k  Tolerance: ±1%  [RES: 1206]
R25  value 5.1k  Tolerance: ±1%  [RES: 1206]
R26  value 5.1k  Tolerance: ±1%  [RES: 1206]
R27  value 30k  Tolerance: ±1%  [RES: 1206]
R28  value 30k  Tolerance: ±1%  [RES: 1206]
R29  value 100k  Tolerance: ±5%  [RES: 1206]
R30  value 100k  Tolerance: ±5%  [RES: 1206]
X26  (no value)  [CON: PLS-2]
X27  (no value)  [CON: PLS-2]
X28  (no value)  [CON: PLS-2]
X29  (no value)  [CON: PLS-2]

### Ports
3.3V, COMPN (out), COMPP (out), DAC (in), IN_N (in), IN_P (in)

### Nets
GND: C18.1 C19.1 C20.1 D7.4(V-) D8.4(V-) D9.4(GND) R22.2 R24.2 R29.1 R30.1 X26.2 X27.2 X28.2 X29.2
3.3V: C18.2 C19.2 C20.2 D7.7(V+) D8.7(V+) D9.8(V+) ; port 3.3V
COMPN: D9.1(OUTA) X29.1 ; port COMPN
COMPP: D9.7(OUTB) X28.1 ; port COMPP
DAC: D9.3(INA+) D9.6(INB-) ; port DAC
IN_N: R21.2 R26.2 ; port IN_N
IN_P: R23.2 R25.2 ; port IN_P
NetD7_2: D7.2(IN-) R21.1 R27.2
NetD7_3: D7.3(IN+) R22.1 R25.1
NetD7_6: D7.6(OUT) D9.5(INB+) R27.1 R29.2 X26.1
NetD8_2: D8.2(IN-) R23.1 R28.2
NetD8_3: D8.3(IN+) R24.1 R26.1
NetD8_6: D8.6(OUT) D9.2(INA-) R28.1 R30.2 X27.1

### Channels
A6: designators end in _A6; ports 3.3V=3.3V COMPN=COMPN COMPP=COMPP DAC=DAC IN_N=NetNT1_1 IN_P=NetNT2_1
A7: designators end in _A7; ports 3.3V=3.3V COMPN=COMPN COMPP=COMPP DAC=DAC IN_N=NetNT3_1 IN_P=NetNT4_1

### Notes on the sheet
- AMPP
- COMPP
- GND
- AMPN
- COMPN
- Подп. и дата
- Инв. № дубл.
- Взам. инв. №
- Инв. № подл.
- Изм.
- Лист
- № докум.
- Подп.
- Дата
- 2.106-A3
- Копировал
- Формат А3
- (in symbol PLS-2) Конт.; Цепь

### Library data of the parts
C18-C20 = Ceramic_1206: as C7 on sheet charge_pump; Package: 1206; HelpURL: https://www.chipdip.ru/product/grm319r71h104k; Temperature: -55...+125°C
D7 D8 = AD8031ARZ: OP amplifier; Manufacturer: Analog Devices Inc.; ValueManufacturerPartNumber: IC op amplifier, Rail-to-Rail, 80MHz, 2.7V ~ 12V, ±1.35V ~ 6V, -40°C ~ 85°C, 8-SOIC; Supply: 2.7V ~ 12V, ±1.35V ~ 6V; OutputType: Rail-to-Rail; GainBandwidth: 80MHz; Slew Rate: 35V/µs; HelpURL: https://www.digikey.com/en/products/detail/analog-devices-inc/AD8031ARZ/620544; Package: 8-SOIC; ComponentType: IC op amplifier; Temperature: -40°C ~ 85°C; PartNumber: AD8031ARZ
D9 = MAX942ExA+: Comparator; Manufacturer: Maxim Integrated Products; ValueManufacturerPartNumber: IC comparator, Rail-to-Rail, 2.7…6V, -40…85°C, DIP-8(P)/SOIC-8(S); Supply: 2.7…6V; OutputType: Rail-to-Rail; Propagation Delay: 80ns; HelpURL: https://www.chipdip.ru/search?searchtext=MAX942; Package: DIP-8(P)/SOIC-8(S); ComponentType: IC comparator; Temperature: -40…85°C
R21 R23 R25 R26 = Resistor_1206: Manufacturer: Yageo; PartNumber: RC1206JR-07100RL; ValueManufacturerPartNumber: Resistor film, 5.1k, ±1%, 1206, 0.25W, -55...+125°C; TypeResistor: Resistor film; Power: 0.25W; Package: 1206; HelpURL: https://www.digikey.com/product-detail/en/yageo/RC1206JR-07100RL/311-100ERCT-ND/732153; Temperature: -55...+125°C
R22 R24 R27 R28 = Resistor_1206: Manufacturer: Yageo; PartNumber: RC1206JR-07100RL; ValueManufacturerPartNumber: Resistor film, 30k, ±1%, 1206, 0.25W, -55...+125°C; TypeResistor: Resistor film; Power: 0.25W; Package: 1206; HelpURL: https://www.digikey.com/product-detail/en/yageo/RC1206JR-07100RL/311-100ERCT-ND/732153; Temperature: -55...+125°C
R29 R30 = Resistor_1206: Manufacturer: Yageo; PartNumber: RC1206JR-07100RL; ValueManufacturerPartNumber: Resistor film, 100k, ±5%, 1206, 0.25W, -55...+125°C; TypeResistor: Resistor film; Power: 0.25W; Package: 1206; HelpURL: https://www.digikey.com/product-detail/en/yageo/RC1206JR-07100RL/311-100ERCT-ND/732153; Temperature: -55...+125°C
X26-X29 = PLS-2: as X17 on sheet charge_pump; HelpURL: https://www.chipdip.ru/product/pls-2; PartNumber: PLS-2; CommentText: PLS-2

## Sheet dac.SchDoc
size 420 x 297 mm; Address1: Address1; Address2: Address2; Address3: Address3; Address4: Address4; DocumentNumber: АБВГ.123456.001 Э3; SheetNumber: 5; SheetTotal: 7; Scale: 1:1; DocumentType: Схема электрическая принципиальная; FirstReferrence: АБВГ.123456.001
Used 2 times, as channels A4, A5. Parts and nets are listed once, with the designators drawn on the sheet.
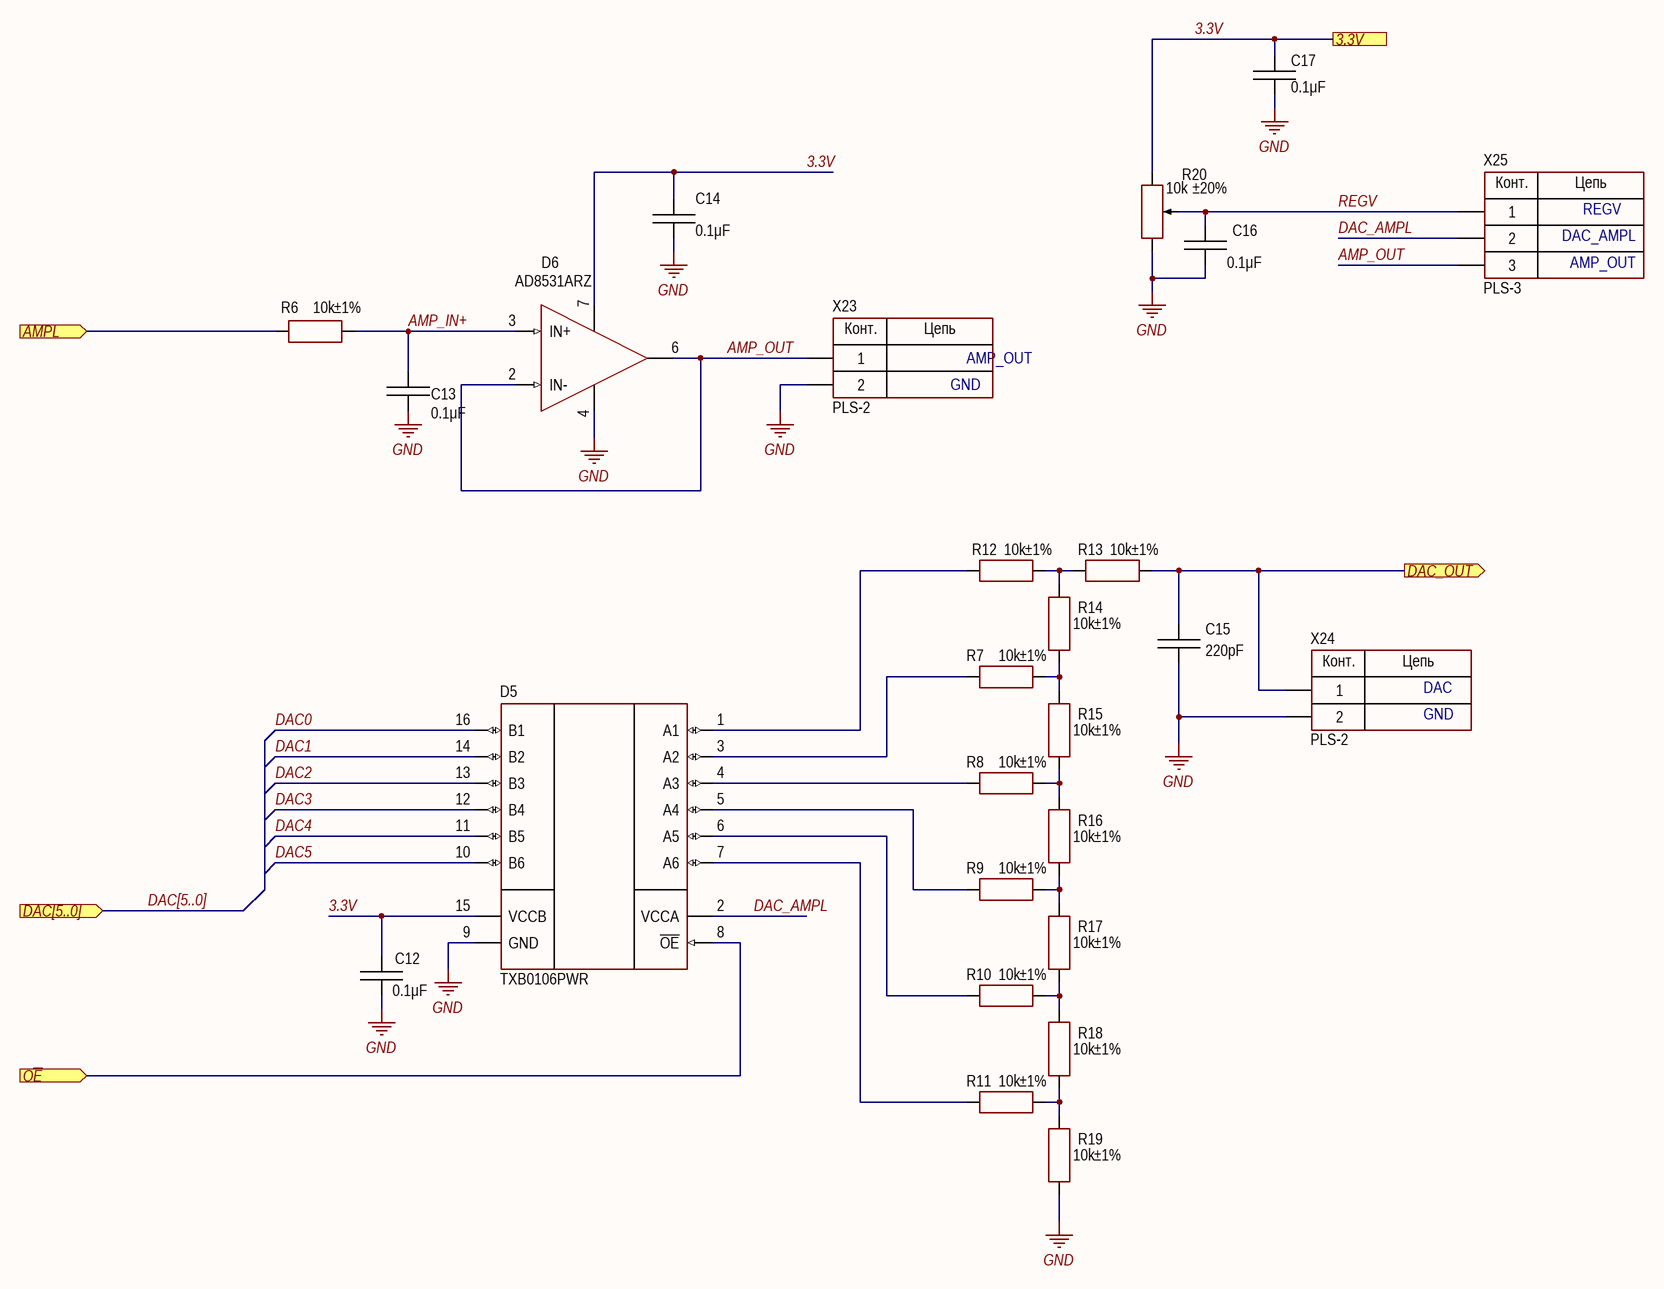
[diagram p4: dac.SchDoc]

### Parts
C12  value 0.1μF  [CAP: 1206]
C13  value 0.1μF  [CAP: 1206]
C14  value 0.1μF  [CAP: 1206]
C15  value 220pF  [CAP: 1206]
C16  value 0.1μF  [CAP: 1206]
C17  value 0.1μF  [CAP: 1206]
D5  (no value)  [16-TSSOP]
D6  (no value)  [8-SOIC]
R6  value 10k  Tolerance: ±1%  [RES: 1206]
R7  value 10k  Tolerance: ±1%  [RES: 1206]
R8  value 10k  Tolerance: ±1%  [RES: 1206]
R9  value 10k  Tolerance: ±1%  [RES: 1206]
R10  value 10k  Tolerance: ±1%  [RES: 1206]
R11  value 10k  Tolerance: ±1%  [RES: 1206]
R12  value 10k  Tolerance: ±1%  [RES: 1206]
R13  value 10k  Tolerance: ±1%  [RES: 1206]
R14  value 10k  Tolerance: ±1%  [RES: 1206]
R15  value 10k  Tolerance: ±1%  [RES: 1206]
R16  value 10k  Tolerance: ±1%  [RES: 1206]
R17  value 10k  Tolerance: ±1%  [RES: 1206]
R18  value 10k  Tolerance: ±1%  [RES: 1206]
R19  value 10k  Tolerance: ±1%  [RES: 1206]
R20  value 10k  Tolerance: ±20%  [RES: 3314G]
X23  (no value)  [CON: PLS-2]
X24  (no value)  [CON: PLS-2]
X25  (no value)  [CON: PLS-3]

### Ports
3.3V, AMPL (in), DAC[5..0] (in), DAC_OUT (out), O~{E} (in)

### Nets
GND: C12.1 C13.1 C14.1 C15.1 C16.1 C17.1 D5.9(GND) D6.4(V-) R19.2 R20.3 X23.2 X24.2
3.3V: C12.2 C14.2 C17.2 D5.15(VCCB) D6.7(V+) R20.1 ; port 3.3V
AMP_IN+: C13.2 D6.3(IN+) R6.1
AMP_OUT: D6.2(IN-) D6.6(OUT) X23.1 X25.3
AMPL: R6.2 ; port AMPL
DAC0: D5.16(B1)
DAC1: D5.14(B2)
DAC2: D5.13(B3)
DAC3: D5.12(B4)
DAC4: D5.11(B5)
DAC5: D5.10(B6)
DAC_AMPL: D5.2(VCCA) X25.2
DAC_OUT: C15.2 R13.1 X24.1 ; port DAC_OUT
O~{E}: D5.8(~{OE}) ; port O~{E}
REGV: C16.2 R20.2 X25.1
NetD5_1: D5.1(A1) R12.2
NetD5_3: D5.3(A2) R7.2
NetD5_4: D5.4(A3) R8.2
NetD5_5: D5.5(A4) R9.2
NetD5_6: D5.6(A5) R10.2
NetD5_7: D5.7(A6) R11.2
NetR7_1: R7.1 R14.2 R15.1
NetR8_1: R8.1 R15.2 R16.1
NetR9_1: R9.1 R16.2 R17.1
NetR10_1: R10.1 R17.2 R18.1
NetR11_1: R11.1 R18.2 R19.1
NetR12_1: R12.1 R13.2 R14.1

### Channels
A4: designators end in _A4; ports 3.3V=3.3V AMPL=NetR6_A4_2 DAC_OUT=DAC O~{E}=NetD5_A4_8
A5: designators end in _A5; ports 3.3V=3.3V AMPL=NetR6_A5_2 DAC_OUT=DAC O~{E}=NetD5_A5_8

### Buses and harness runs
bus DAC[5..0] = port DAC[5..0]

### Notes on the sheet
- REGV
- DAC_AMPL
- AMP_OUT
- GND
- DAC
- Подп. и дата
- Инв. № дубл.
- Взам. инв. №
- Инв. № подл.
- Изм.
- Лист
- № докум.
- Подп.
- Дата
- 2.106-A3
- Копировал
- Формат А3
- (in symbol PLS-2) Конт.; Цепь
- (in symbol PLS-3) Конт.; Цепь

### Library data of the parts
C12-C14 C16 C17 = Ceramic_1206: as C7 on sheet charge_pump; Package: 1206; HelpURL: https://www.chipdip.ru/product/grm319r71h104k; Temperature: -55...+125°C
C15 = Ceramic_1206: Manufacturer: Yageo; PartNumber: CC1206KRX7R9BB104; ValueManufacturerPartNumber: Ceramic capacitor, 220pF, X7R, ±10%, 50V, 1206, -55...+125°C; TypeCapacitor: Ceramic capacitor; Tolerance: ±10%; TypeDielectric: X7R; Voltage: 50V; Package: 1206; HelpURL: https://www.digikey.com/product-detail/en/yageo/CC1206KRX7R9BB104/311-1179-1-ND/303089; Temperature: -55...+125°C
D5 = TXB0106PWR: 6-Bit Bidirectional Level-Shifting and Voltage Translator; Manufacturer: Texas Instruments; ValueManufacturerPartNumber: 6-Bit Bidirectional Level-Shifting and Voltage Translator, 1.2..3..6V   1.65..5.5V, -40...+85°C, 16-TSSOP; Supply: 1.2..3..6V   1.65..5.5V; HelpURL: https://www.chipdip.ru/product/txb0106pwr-2; Package: 16-TSSOP; ComponentType: 6-Bit Bidirectional Level-Shifting and Voltage Translator; Temperature: -40...+85°C; PartNumber: TXB0106PWR
D6 = AD8531ARZ: OP amplifier Rail-to-Rail 3MHz; Manufacturer: Analog Devices Inc.; ValueManufacturerPartNumber: IC op amplifier, Rail-to-Rail, 3MHz, 2.7V ~ 6V, ±1.35V ~3V, -40°C ~ 85°C, 8-SOIC; Supply: 2.7V ~ 6V, ±1.35V ~3V; Slew Rate: 3.5V/µs; HelpURL: https://www.chipdip.ru/product/ad8531arz; Package: 8-SOIC; ComponentType: IC op amplifier; Temperature: -40°C ~ 85°C; OutputType: Rail-to-Rail; GainBandwidth: 3MHz; PartNumber: AD8531ARZ
R6-R19 = Resistor_1206: Manufacturer: Yageo; PartNumber: RC1206JR-07100RL; ValueManufacturerPartNumber: Resistor film, 10k, ±1%, 1206, 0.25W, -55...+125°C; TypeResistor: Resistor film; Power: 0.25W; Package: 1206; HelpURL: https://www.digikey.com/product-detail/en/yageo/RC1206JR-07100RL/311-100ERCT-ND/732153; Temperature: -55...+125°C
R20 = Trimmer: as R2 on sheet charge_pump; Package: 3314G; HelpURL: https://www.chipdip.ru/product/3314g-1-103e; ValueManufacturerPartNumber: =TypeResistor+', '+Value+', '+Tolerance+', '+Package+', '+Power+', '+Temperature; Temperature: -55...+125°C
X23 X24 = PLS-2: as X17 on sheet charge_pump; HelpURL: https://www.chipdip.ru/product/pls-2; PartNumber: PLS-2; CommentText: PLS-2
X25 = PLS-3: as X20 on sheet charge_pump; HelpURL: https://www.chipdip.ru/product/pls-3; PartNumber: PLS-3; CommentText: PLS-3

## Sheet power_supply.SchDoc
size 420 x 297 mm; Address1: Address1; Address2: Address2; Address3: Address3; Address4: Address4; DocumentNumber: АБВГ.123456.001 Э3; SheetNumber: 2; SheetTotal: 7; Scale: 1:1; DocumentType: Схема электрическая принципиальная; FirstReferrence: АБВГ.123456.001
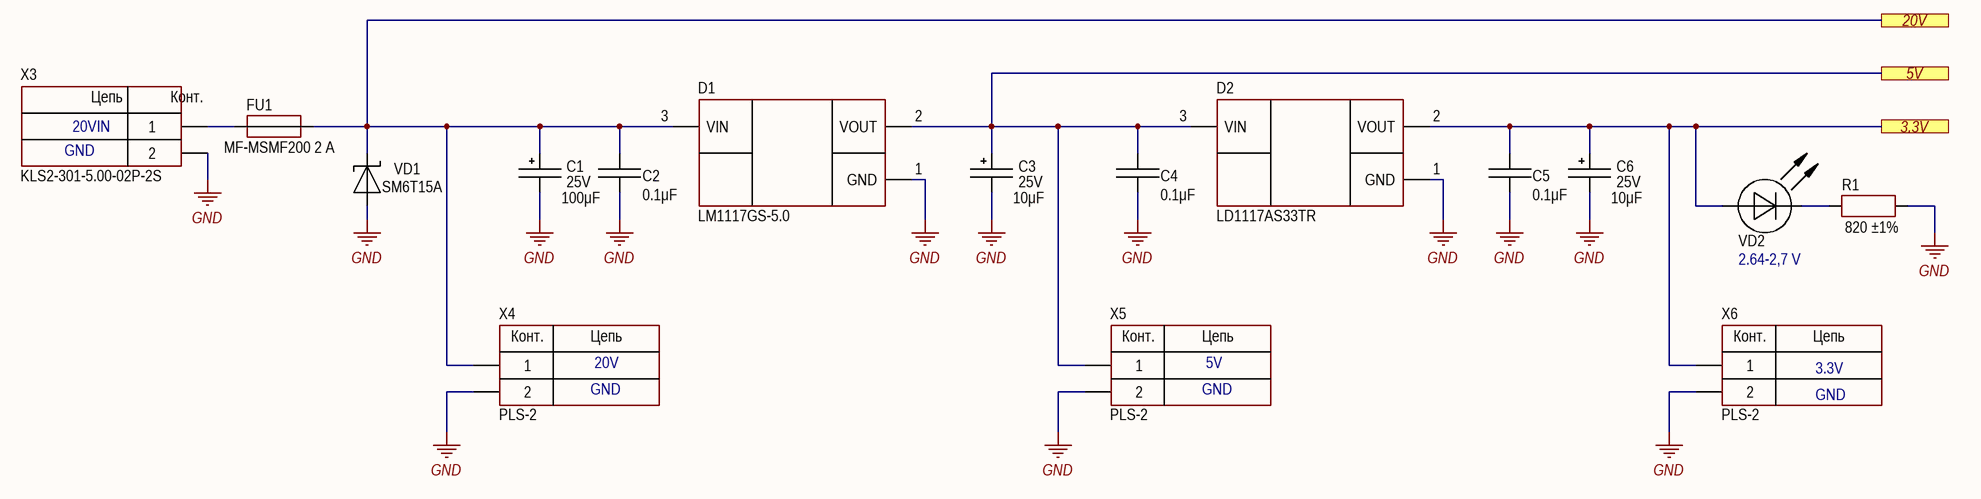
[diagram p5: power_supply.SchDoc]

### Parts
C1  value 100μF  Voltage: 25V  [CAP: D6.3C2.5H11]
C2  value 0.1μF  [CAP: 1206]
C3  value 10μF  Voltage: 25V  [CAP: D6.3C2.5H11]
C4  value 0.1μF  [CAP: 1206]
C5  value 0.1μF  [CAP: 1206]
C6  value 10μF  Voltage: 25V  [CAP: D6.3C2.5H11]
D1  PartNumber: LM1117GS-5.0  [SOT223]  (hidden comment: *)
D2  PartNumber: LD1117AS33TR  [SOT223]  (hidden comment: *)
FU1  PartNumber: MF-MSMF200 2 A  [FUSE: 1812]
R1  value 820  Tolerance: ±1%  [RES: 1206]
VD1  PartNumber: SM6T15A  [DIODE: SMB]
VD2  (no value)  [LED: 1206W]
X3  CommentText: KLS2-301-5.00-02P-2S  [CON: Terminal 2p 5mm]
X4  (no value)  [CON: PLS-2]
X5  (no value)  [CON: PLS-2]
X6  (no value)  [CON: PLS-2]

### Ports
3.3V, 5V, 20V

### Nets
GND: C1.2 C2.1 C3.2 C4.1 C5.1 C6.2 D1.1(GND) D2.1(GND) R1.2 VD1.1(A) X3.2 X4.2 X5.2 X6.2
3.3V: C5.2 C6.1 D2.2(VOUT) VD2.1(A) X6.1 ; port 3.3V
5V: C3.1 C4.2 D1.2(VOUT) D2.3(VIN) X5.1 ; port 5V
20V: C1.1 C2.2 D1.3(VIN) FU1.2 VD1.2(C) X4.1 ; port 20V
NetFU1_1: FU1.1 X3.1
NetR1_1: R1.1 VD2.2(C)

### Notes on the sheet
- GND
- 20VIN
- 2.64-2,7 V
- 20V
- 5V
- 3.3V
- Подп. и дата
- Инв. № дубл.
- Взам. инв. №
- Инв. № подл.
- Изм.
- Лист
- № докум.
- Подп.
- Дата
- 2.106-A3
- Копировал
- Формат А3
- (in symbol PLS-2) Конт.; Цепь
- (in symbol Terminal block 2) Цепь; Конт.

### Library data of the parts
C1 = Aluminium: Manufacturer: Wurth; PartNumber: 860080475013; ValueManufacturerPartNumber: Aluminium capacitor, 100μF, 25V, ±20%, 54mOhm, 14x10x5 mm, -55...+105°C; TypeCapacitor: Aluminium capacitor; Tolerance: ±20%; Impedance: 54mOhm; Package: 14x10x5 mm; HelpURL: https://www.digikey.com/product-detail/en/wurth-electronics-inc/860080475013/732-9029-1-ND/5728972; Temperature: -55...+105°C
C2 C4 C5 = Ceramic_1206: as C7 on sheet charge_pump; Package: 1206; HelpURL: https://www.chipdip.ru/product/grm319r71h104k; Temperature: -55...+125°C
C3 C6 = Aluminium: Manufacturer: Wurth; PartNumber: 860080475013; ValueManufacturerPartNumber: Aluminium capacitor, 10μF, 25V, ±20%, 54mOhm, 14x10x5 mm, -55...+105°C; TypeCapacitor: Aluminium capacitor; Tolerance: ±20%; Impedance: 54mOhm; Package: 14x10x5 mm; HelpURL: https://www.digikey.com/product-detail/en/wurth-electronics-inc/860080475013/732-9029-1-ND/5728972; Temperature: -55...+105°C
D1 D2 = AMS1117-5.0: Linear voltage regulator; Manufacturer: *; Package: SOT223; ComponentType: Linear voltage regulator; ValueManufacturerPartNumber: *; Temperature: *; VoltageInput: *; MaxDropout: *; CurrentOutput: *; VoltageOutput: *
  D1: HelpURL: https://www.chipdip.ru/product/lm1117gs-5.0
  D2: HelpURL: https://www.chipdip.ru/product/ld1117as33tr
FU1 = FUSE: Manufacturer: Bourns; ValueManufacturerPartNumber: 2 A,  1812, -40...85; Value: 2 A; Package: 1812; HelpURL: https://www.chipdip.ru/product/mf-msmf200-2-a-1812; Temperature: -40...85
R1 = Resistor_1206: as R31 on sheet driver_bridge; Package: 1206; HelpURL: https://www.chipdip.ru/product0/9000079905; Temperature: -55...+125°C
VD1 = TVS_single_unidir: Manufacturer: ST Microelectronics; TypeDiode: ESD protection diode; PeakPulseCurrent: 147A(8/20 us); PeakPulsePower: 600W; BreakdownVoltage: 14.3... 15.8 V; ReverseStandoffVoltage: 12.8 V; Package: do-214aa/smb; HelpURL: https://www.chipdip.ru/product/sm6t15a; ValueManufacturerPartNumber: =TypeDiode+', '+ReverseStandoffVoltage+', '+PeakPulsePower+', ''+Package+', '+Temperature; Temperature: -55…+150
VD2 = LED_single: ValueManufacturerPartNumber: LED, Green, *, *, *, -55...+150°C; TypeDiode: LED; ColorParameter: Green; Manufacturer: *; Package: *; HelpURL: *; Temperature: -55...+150°C; Current: *; VoltageDrop: *; PartNumber: *
X3 = Terminal block 2: as X1 on sheet main; Manufacturer: *; HelpURL: *; PartNumber: KLS2-301-5.00-02P-2S; VoltageMax: *; Pitch: *; CurrentMax: *
X4-X6 = PLS-2: as X17 on sheet charge_pump; HelpURL: https://www.chipdip.ru/product/pls-2; PartNumber: PLS-2; CommentText: PLS-2

## Sheet fpga.SchDoc
size 594 x 420 mm; Address1: Address1; Address2: Address2; Address3: Address3; Address4: Address4; DocumentNumber: АБВГ.123456.001 Э3; SheetNumber: 3; SheetTotal: 7; Scale: 1:1; DocumentType: Схема электрическая принципиальная; FirstReferrence: АБВГ.123456.001
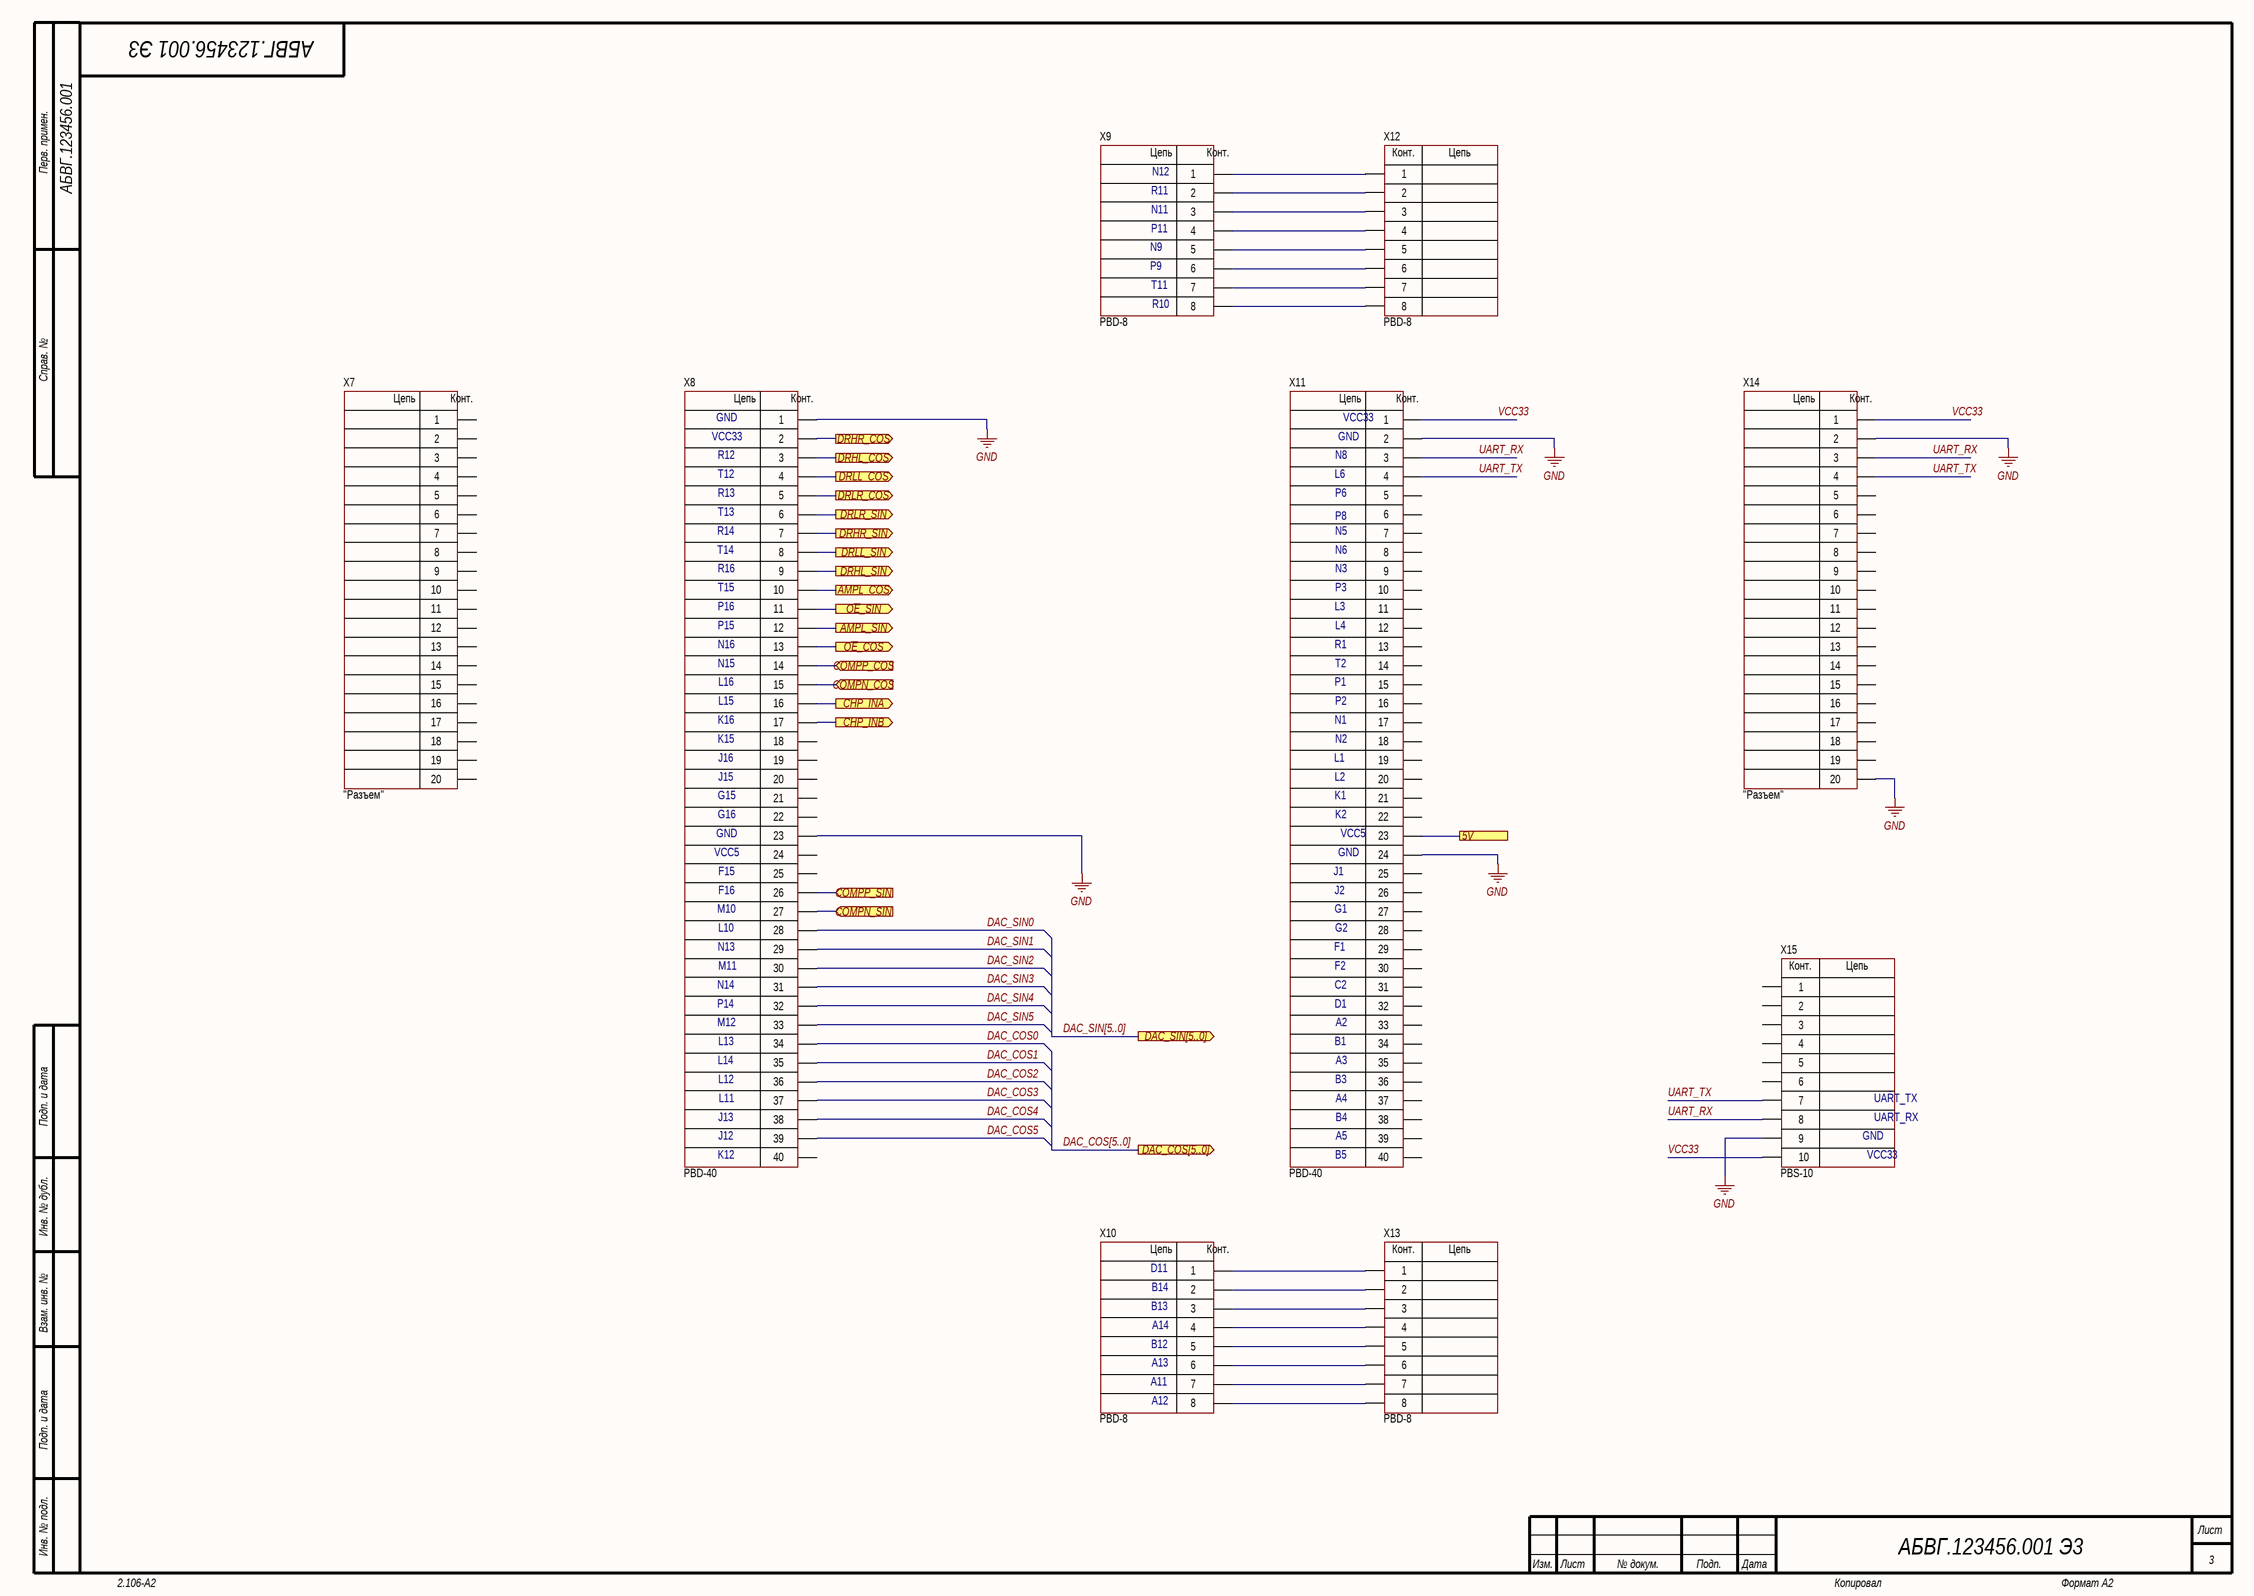
[diagram p6: fpga.SchDoc]

### Parts
X7  CommentText: "Разъем"  [CON: PBD-20]
X8  (no value)  [CON: PBD-40 (2.00)]
X9  (no value)  [CON: PBD2-8 (2.00)]
X10  (no value)  [CON: PBD2-8 (2.00)]
X11  (no value)  [CON: PBD-40 (2.00)]
X12  (no value)  [CON: PBD-8]
X13  (no value)  [CON: PBD-8]
X14  CommentText: "Разъем"  [CON: PBD-20]
X15  PartNumber: PBS-10  [CON: PBS-10R]

### Ports
5V, AMPL_COS (out), AMPL_SIN (out), CHP_INA (out), CHP_INB (out), COMPN_COS (in), COMPN_SIN (in), COMPP_COS (in), COMPP_SIN (in), DAC_COS[5..0] (out), DAC_SIN[5..0] (out), DRHL_COS (out), DRHL_SIN (out), DRHR_COS (out), DRHR_SIN (out), DRLL_COS (out), DRLL_SIN (out), DRLR_COS (out), DRLR_SIN (out), O~{E}_COS (out), O~{E}_SIN (out)

### Nets
GND: X8.1 X8.23 X11.2 X11.24 X14.2 X14.20 X15.9
5V: X11.23 ; port 5V
COMPN: X8.27 ; port COMPN_SIN
COMPN: X8.15 ; port COMPN_COS  [a separate net that carries the same name]
COMPP: X8.26 ; port COMPP_SIN
COMPP: X8.14 ; port COMPP_COS  [a separate net that carries the same name]
DAC_COS0: X8.34  [project net DAC0]
DAC_COS1: X8.35  [project net DAC1]
DAC_COS2: X8.36  [project net DAC2]
DAC_COS3: X8.37  [project net DAC3]
DAC_COS4: X8.38  [project net DAC4]
DAC_COS5: X8.39  [project net DAC5]
DAC_SIN0: X8.28  [project net DAC0]
DAC_SIN1: X8.29  [project net DAC1]
DAC_SIN2: X8.30  [project net DAC2]
DAC_SIN3: X8.31  [project net DAC3]
DAC_SIN4: X8.32  [project net DAC4]
DAC_SIN5: X8.33  [project net DAC5]
UART_RX: X11.3 X14.3 X15.8
UART_TX: X11.4 X14.4 X15.7
VCC33: X11.1 X14.1 X15.10
NetD4_2: X8.16 ; port CHP_INA
NetD4_4: X8.17 ; port CHP_INB
NetD5_A4_8: X8.11 ; port O~{E}_SIN
NetD5_A5_8: X8.13 ; port O~{E}_COS
NetD10_A8_2: X8.9 ; port DRHL_SIN
NetD10_A8_4: X8.7 ; port DRHR_SIN
NetD10_A9_2: X8.3 ; port DRHL_COS
NetD10_A9_4: X8.2 ; port DRHR_COS
NetD11_A8_2: X8.8 ; port DRLL_SIN
NetD11_A8_4: X8.6 ; port DRLR_SIN
NetD11_A9_2: X8.4 ; port DRLL_COS
NetD11_A9_4: X8.5 ; port DRLR_COS
NetR6_A4_2: X8.12 ; port AMPL_SIN
NetR6_A5_2: X8.10 ; port AMPL_COS
NetX9_1: X9.1 X12.1
NetX9_2: X9.2 X12.2
NetX9_3: X9.3 X12.3
NetX9_4: X9.4 X12.4
NetX9_5: X9.5 X12.5
NetX9_6: X9.6 X12.6
NetX9_7: X9.7 X12.7
NetX9_8: X9.8 X12.8
NetX10_1: X10.1 X13.1
NetX10_2: X10.2 X13.2
NetX10_3: X10.3 X13.3
NetX10_4: X10.4 X13.4
NetX10_5: X10.5 X13.5
NetX10_6: X10.6 X13.6
NetX10_7: X10.7 X13.7
NetX10_8: X10.8 X13.8

Not connected (* = marked no-connect by the designer): X7 1 2 3 4 5 6 7 8 9 10 11 12 13 14 15 16 17 18 19 20; X8 18 19 20 21 22 24 25 40; X11 5 6 7 8 9 10 11 12 13 14 15 16 17 18 19 20 21 22 25 26 27 28 29 30 31 32 33 34 35 36 37 38 39 40; X14 5 6 7 8 9 10 11 12 13 14 15 16 17 18 19; X15 1 2 3 4 5 6

### Buses and harness runs
bus DAC_COS[5..0] = port DAC_COS[5..0]
bus DAC_SIN[5..0] = port DAC_SIN[5..0]

### Notes on the sheet
- R11
- N11
- N12
- N9
- P11
- P9
- T11
- R10
- VCC33
- GND
- R12
- N8
- T12
- R13
- L6
- P6
- T14
- R14
- T13
- P8
- N5
- N6
- R16
- T15
- N3
- P3
- P16
- N16
- P15
- R1
- L3
- L4
- N15
- L16
- P1
- T2
- K16
- K15
- L15
- N1
- P2
- N2
- J16
- J15
- L1
- L2
- G15
- G16
- K1
- K2
- VCC5
- F15
- J1
- M10
- F16
- L10
- J2
- G1
- G2
- N13
- M11
- F1
- F2
- N14
- M12
- P14
- D1
- C2
- A2
- L14
- L13
- L12
- B1
- B3
- A3
- J13
- L11
- B4
- A4
- UART_RX
- UART_TX
- K12
- J12
- B5
- A5
- D11
- B13
- B14
- B12
- A13
- A14
- A11
- A12
- Перв. примен.
- Справ. №
- Подп. и дата
- Инв. № дубл.
- Взам. инв. №
- Инв. № подл.
- Изм.
- Лист
- № докум.
- Подп.
- Дата
- 2.106-A2
- Копировал
- Формат А2
- (in symbol PBD-8) Цепь; Конт.
- (in symbol PBD-20) Цепь; Конт.
- (in symbol PBD-40) Цепь; Конт.
- (in symbol PBS-10R) Конт.; Цепь

### Library data of the parts
X7 X14 = PBD-20: Manufacturer: Connfly; ValueManufacturerPartNumber: Connector, 20pin, 2.54mm, 500VAC, 3A; TypeConnector: Connector; VoltageMax: 500VAC; Pitch: 2.54mm; CurrentMax: 3A; Multichannel: 20pin; HelpURL: https://www.chipdip.ru/product/pbd-20; PartNumber: PBD-20
X8 X11 = PBD-40: Manufacturer: Connfly; ValueManufacturerPartNumber: Connector, 20pin, 2.54mm, 500VAC, 3A; TypeConnector: Connector; VoltageMax: 500VAC; Pitch: 2.54mm; CurrentMax: 3A; Multichannel: 20pin; CommentText: "Разъем"; HelpURL: https://www.chipdip.ru/product/pls-20; PartNumber: PBD-40
X9 X10 X12 X13 = PBD-8: Manufacturer: Connfly; ValueManufacturerPartNumber: Connector, 8pin, 2.54mm, 500VAC, 3A; TypeConnector: Connector; VoltageMax: 500VAC; Pitch: 2.54mm; CurrentMax: 3A; Multichannel: 8pin; CommentText: "Разъем"; HelpURL: https://www.chipdip.ru/product/pbd-8; PartNumber: PBD-8
X15 = PBS-10R: Manufacturer: Connfly; ValueManufacturerPartNumber: Connector, 10pin, 2.54mm, 500VAC, 3A; TypeConnector: Connector; VoltageMax: 500VAC; Pitch: 2.54mm; CurrentMax: 3A; Multichannel: 10pin; CommentText: "Разъем"; HelpURL: https://www.chipdip.ru/product/pbs-10

## Nets that join several sheets
GND: charge_pump (11 pins), A8 (13 pins), A6 (14 pins), A4 (12 pins), power_supply (14 pins), fpga (7 pins), A9 (13 pins), A7 (14 pins), A5 (12 pins)
3.3V: A6 (6 pins), A4 (6 pins), power_supply (5 pins), A7 (6 pins), A5 (6 pins)
5V: power_supply (5 pins), fpga (X11.23)
20V: charge_pump (C7.2 D3.3 VD3.1 VD4.1), A8 (6 pins), power_supply (6 pins), A9 (6 pins)
25V: charge_pump (X20.2), A8 (C23_A8.2 D10_A8.6), A9 (C23_A9.2 D10_A9.6)
COMPN: A6 (D9_A6.1 X29_A6.1), fpga (X8.27)
COMPN: fpga (X8.15), A7 (D9_A7.1 X29_A7.1)
COMPP: A6 (D9_A6.7 X28_A6.1), fpga (X8.26)
COMPP: fpga (X8.14), A7 (D9_A7.7 X28_A7.1)
DAC: A6 (D9_A6.3 D9_A6.6), A4 (C15_A4.2 R13_A4.1 X24_A4.1)
DAC: A7 (D9_A7.3 D9_A7.6), A5 (C15_A5.2 R13_A5.1 X24_A5.1)
DAC0: A4 (D5_A4.16), fpga (X8.28)
DAC0: fpga (X8.34), A5 (D5_A5.16)
DAC1: A4 (D5_A4.14), fpga (X8.29)
DAC1: fpga (X8.35), A5 (D5_A5.14)
DAC2: A4 (D5_A4.13), fpga (X8.30)
DAC2: fpga (X8.36), A5 (D5_A5.13)
DAC3: A4 (D5_A4.12), fpga (X8.31)
DAC3: fpga (X8.37), A5 (D5_A5.12)
DAC4: A4 (D5_A4.11), fpga (X8.32)
DAC4: fpga (X8.38), A5 (D5_A5.11)
DAC5: A4 (D5_A4.10), fpga (X8.33)
DAC5: fpga (X8.39), A5 (D5_A5.10)
NetD4_2: charge_pump (D4.2), fpga (X8.16)
NetD4_4: charge_pump (D4.4), fpga (X8.17)
NetD5_A4_8: A4 (D5_A4.8), fpga (X8.11)
NetD5_A5_8: fpga (X8.13), A5 (D5_A5.8)
NetD10_A8_2: A8 (D10_A8.2), fpga (X8.9)
NetD10_A8_4: A8 (D10_A8.4), fpga (X8.7)
NetD10_A9_2: fpga (X8.3), A9 (D10_A9.2)
NetD10_A9_4: fpga (X8.2), A9 (D10_A9.4)
NetD11_A8_2: A8 (D11_A8.2), fpga (X8.8)
NetD11_A8_4: A8 (D11_A8.4), fpga (X8.6)
NetD11_A9_2: fpga (X8.4), A9 (D11_A9.2)
NetD11_A9_4: fpga (X8.5), A9 (D11_A9.4)
NetNT1_1: main (NT1.1), A6 (R21_A6.2 R26_A6.2)
NetNT2_1: main (NT2.1), A6 (R23_A6.2 R25_A6.2)
NetNT3_1: main (NT3.1), A7 (R21_A7.2 R26_A7.2)
NetNT4_1: main (NT4.1), A7 (R23_A7.2 R25_A7.2)
NetR6_A4_2: A4 (R6_A4.2), fpga (X8.12)
NetR6_A5_2: fpga (X8.10), A5 (R6_A5.2)
OUTA: main (X1.1), A8 (VT1_A8.2 VT2_A8.3 X34_A8.1)
OUTA: main (X2.1), A9 (VT1_A9.2 VT2_A9.3 X34_A9.1)
OUTB: main (X1.2), A8 (VT3_A8.3 VT4_A8.2 X34_A8.2)
OUTB: main (X2.2), A9 (VT3_A9.3 VT4_A9.2 X34_A9.2)
SENS_N: main (NT1.2), A8 (NT4_A8.1)
SENS_N: main (NT3.2), A9 (NT4_A9.1)
SENS_P: main (NT2.2), A8 (NT3_A8.1)
SENS_P: main (NT4.2), A9 (NT3_A9.1)